# EAGLE design blockybit (EAGLE 9.2.2)

## Sheet 1 of 2
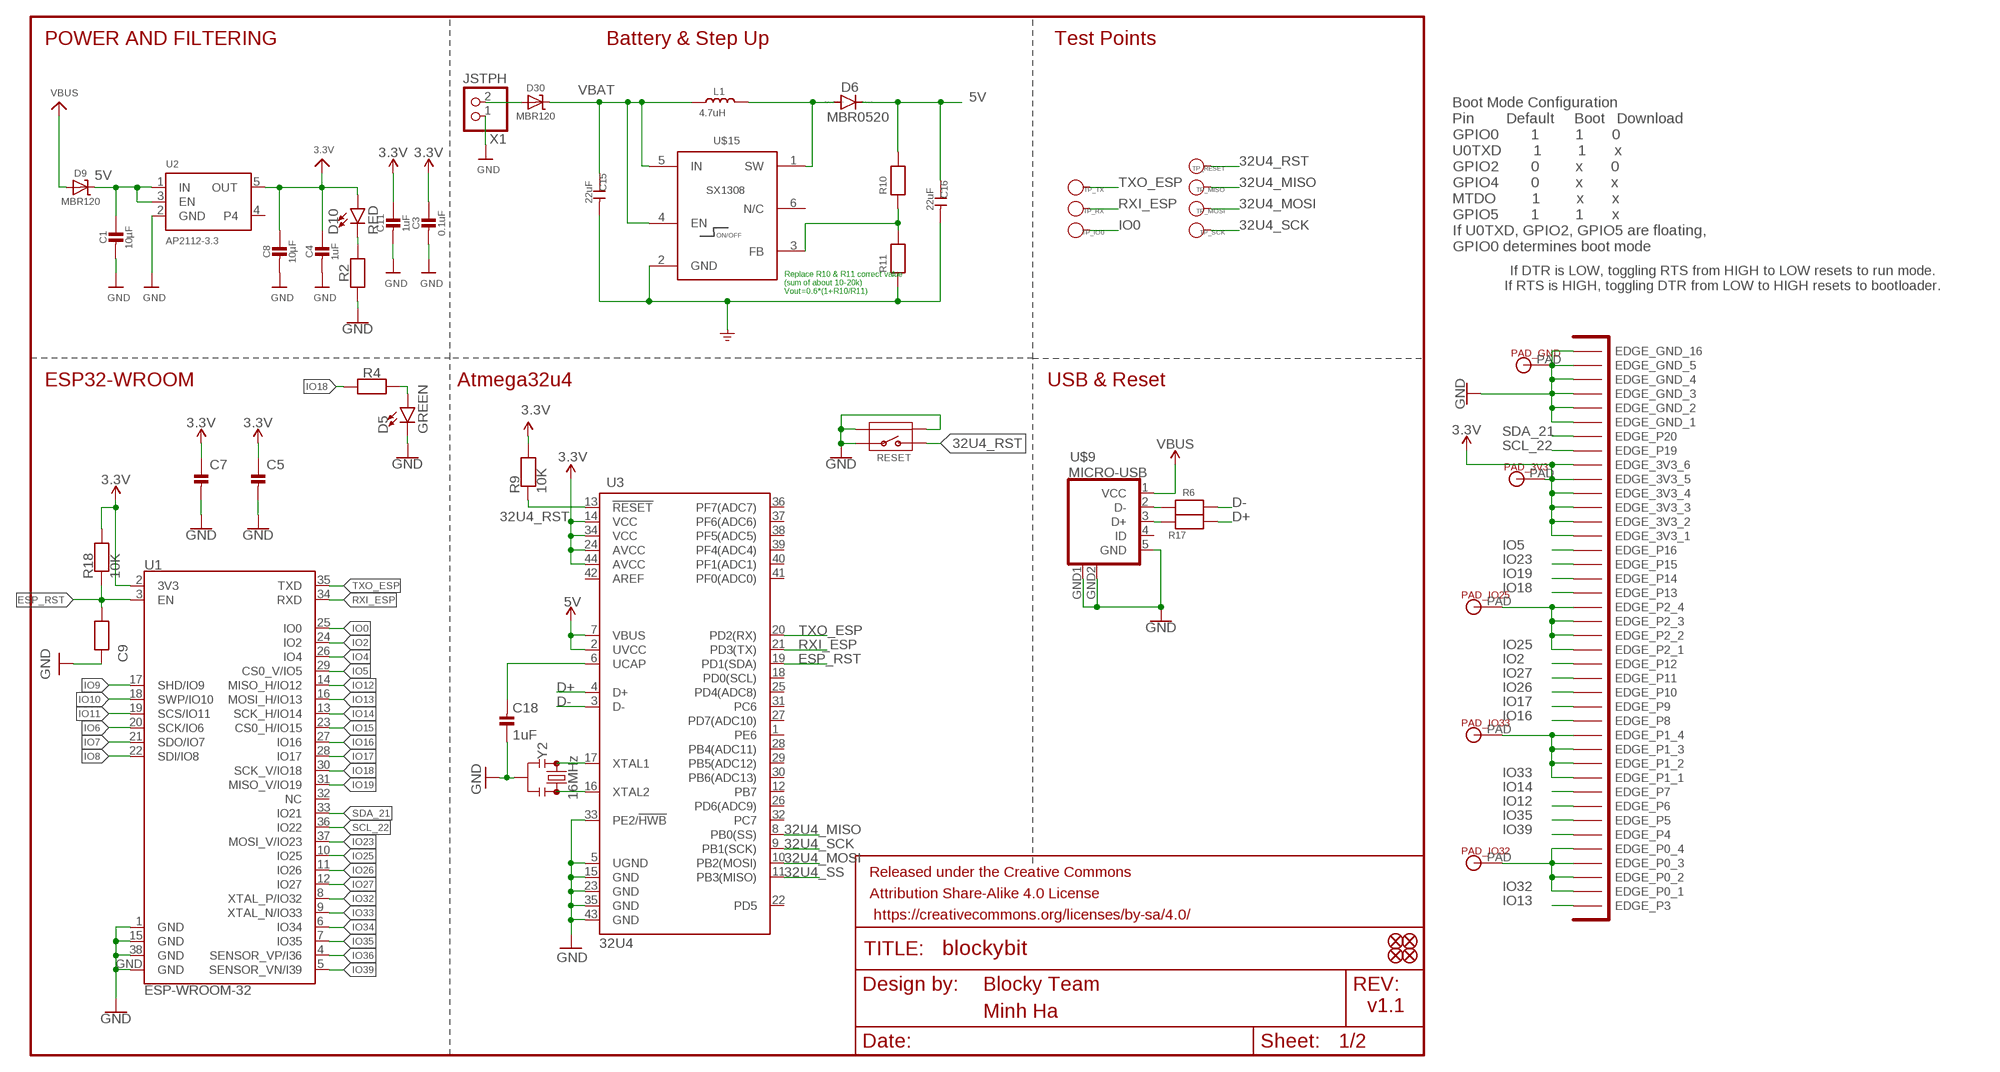
[diagram p0: schematic, sheet 1]

### Parts
C1  10µF  CAP_CERAMIC_0603  [_0603]
C3  0.1uF  CAP_CERAMIC_0603  [_0603]
C4  1uF  CAP_CERAMIC_0603  [_0603]
C5  10uF  CAP_CERAMIC_0603  [_0603]
C7  0.1uF  CAP_CERAMIC_0603  [_0603]
C8  10µF  CAP_CERAMIC_0603  [_0603]
C9  0.1uF  RESISTOR_0603  [_0603]
C11  1uF  CAP_CERAMIC_0603  [_0603]
C15  22uF  C-0805  [C0805]
C16  22uF  C-0805  [C0805]
C18  1uF  CAP_CERAMIC_0603  [_0603]
D5  GREEN  LED-BLUE0603  [LED-0603]
D6  MBR0520  MBR0520LT  [SOD123]
D9  MBR120  DIODE-SCHOTTKYSOD-123  [SOD-123]
D10  RED  LED-RED0603  [LED-0603]
D30  MBR120  DIODE-SCHOTTKYSOD-123  [SOD-123]
FD1  FIDUCIAL1X2  [FIDUCIAL-1X2]
FD2  FIDUCIAL1X2  [FIDUCIAL-1X2]
FD3  FIDUCIAL1X2  [FIDUCIAL-1X2]
FD4  FIDUCIAL1X2  [FIDUCIAL-1X2]
FRAME1  FRAME-LETTERNO_PACKAGE  [DUMMY]
L1  4.7uH  CD32'4R7'  [SD32-4R7MC]
PAD_3V3  MICROBIT_PADMICROBIT_PAD_SMALL  [MICROBIT_PAD_SMALL]
PAD_GND  MICROBIT_PADMICROBIT_PAD_SMALL  [MICROBIT_PAD_SMALL]
PAD_IO25  MICROBIT_PADMICROBIT_PAD_SMALL  [MICROBIT_PAD_SMALL]
PAD_IO32  MICROBIT_PADMICROBIT_PAD_SMALL  [MICROBIT_PAD_SMALL]
PAD_IO33  MICROBIT_PADMICROBIT_PAD_SMALL  [MICROBIT_PAD_SMALL]
R2  1k  RESISTOR_0603  [_0603]
R4  1k  RESISTOR_0603  [_0603]
R6  22R  RESISTOR_0603  [_0603]
R9  10K  RESISTOR_0603  [_0603]
R10  13K  RESISTOR_0603  [_0603]
R11  2K  RESISTOR_0603  [_0603]
R17  22R  RESISTOR_0603  [_0603]
R18  10K  RESISTOR_0603  [_0603]
RESET  BUTTON-4P-REINFORCE'TS-1188E'  [4P-SMD-7X3.5X3.5H]
TP_IO0  PAD-TEST-POINT'3535'  [TP_3535]
TP_MISO  PAD-TEST-POINT'3535'  [TP_3535]
TP_MOSI  PAD-TEST-POINT'3535'  [TP_3535]
TP_RESET  PAD-TEST-POINT'3535'  [TP_3535]
TP_RX  PAD-TEST-POINT'3535'  [TP_3535]
TP_SCK  PAD-TEST-POINT'3535'  [TP_3535]
TP_TX  PAD-TEST-POINT'3535'  [TP_3535]
U1  ESP-WROOM-32  [ESP-WROOM-32]
U2  AP2112-3.3  VREG_SOT23-5  [SOT23-5]
U3  32U4  ATMEGA32U4QFN  [QFN-44]
U$1  BBC_EDGE  [BBC_EDGE]
U$9  MICRO-USB  [MICRO-USB]
U$15  SX1308  [SOT-23-6]
X1  JSTPH  CON_JST_PH_2PIN  [JSTPH2]
Y2  16MHz  RESONATOR-8MHZSMD_3.2X1.3  [RESONATOR-SMD-3.2X1.3]

### Nets
3.3V [usbvcc]: C3.1 C4.1 C5.1 C7.1 C8.1 C11.1 D10.A PAD_3V3.PAD R9.2 R18.2 U1.2(3V3) U2.5(OUT) U3.14(VCC) U3.24(AVCC) U3.34(VCC) U3.44(AVCC) U$1.P$67(EDGE_3V3_1) U$1.P$68(EDGE_3V3_2) U$1.P$69(EDGE_3V3_3) U$1.P$70(EDGE_3V3_4) U$1.P$71(EDGE_3V3_5) U$1.P$72(EDGE_3V3_6) ; supply symbol labelled VCC ; also sheet 2
5V [5v]: C1.1 C16.1 D6.C D9.C R10.2 U2.1(IN) U2.3(EN) U3.2(UVCC) U3.7(VBUS) ; supply symbol labelled VCC ; also sheet 2
32U4_MISO: TP_MISO.T U3.8(PB0(SS))
32U4_MOSI: TP_MOSI.T U3.10(PB2(MOSI))
32U4_RST: R9.1 RESET.2 TP_RESET.T U3.13(!RESET)
32U4_SCK: TP_SCK.T U3.9(PB1(SCK))
32U4_SS: U3.11(PB3(MISO))
D+: R17.1 U3.4(D+)
D-: R6.1 U3.3(D-)
ESP_RST: C9.1 R18.1 U1.3(EN) U3.19(PD1(SDA))
FB1: R10.1 R11.2 U$15.3(FB)
GND [vcc]: C1.2 C3.2 C4.2 C5.2 C7.2 C8.2 C9.2 C11.2 C15.2 C16.2 C18.1 D5.C PAD_GND.PAD R2.1 R11.1 RESET.1 RESET.S1 RESET.S2 U1.1(GND) U1.15(GND) U1.38(GND) U1.GND U2.2(GND) U3.5(UGND) U3.15(GND) U3.23(GND) U3.33(PE2/!HWB) U3.35(GND) U3.43(GND) U$1.P$75(EDGE_GND_1) U$1.P$76(EDGE_GND_2) U$1.P$77(EDGE_GND_3) U$1.P$78(EDGE_GND_4) U$1.P$79(EDGE_GND_5) U$1.P$80(EDGE_GND_16) U$9.5(GND) U$9.GND1(GND) U$9.GND2(GND) U$15.2(GND) X1.1 Y2.2 ; also sheet 2
IO0: TP_IO0.T U1.25(IO0)
IO2: U1.24(IO2) U$1.P$58(EDGE_P12)
IO4: U1.26(IO4) ; also sheet 2
IO5: U1.29(CS0_V/IO5) U$1.P$66(EDGE_P16)
IO6: U1.20(SCK/IO6)
IO7: U1.21(SDO/IO7)
IO8: U1.22(SDI/IO8)
IO9: U1.17(SHD/IO9)
IO10: U1.18(SWP/IO10)
IO11: U1.19(SCS/IO11)
IO12: U1.14(MISO_H/IO12) U$1.P$48(EDGE_P6)
IO13: U1.16(MOSI_H/IO13) U$1.P$41(EDGE_P3)
IO14: U1.13(SCK_H/IO14) U$1.P$49(EDGE_P7)
IO15: U1.23(CS0_H/IO15)
IO16: U1.27(IO16) U$1.P$54(EDGE_P8)
IO17: U1.28(IO17) U$1.P$55(EDGE_P9)
IO18: R4.1 U1.30(SCK_V/IO18) U$1.P$63(EDGE_P13)
IO19: U1.31(MISO_V/IO19) U$1.P$64(EDGE_P14)
IO23: U1.37(MOSI_V/IO23) U$1.P$65(EDGE_P15)
IO25: PAD_IO25.PAD U1.10(IO25) U$1.P$59(EDGE_P2_1) U$1.P$60(EDGE_P2_2) U$1.P$61(EDGE_P2_3) U$1.P$62(EDGE_P2_4) ; also sheet 2
IO26: U1.11(IO26) U$1.P$56(EDGE_P10)
IO27: U1.12(IO27) U$1.P$57(EDGE_P11) ; also sheet 2
IO32: PAD_IO32.PAD U1.8(XTAL_P/IO32) U$1.P$42(EDGE_P0_1) U$1.P$43(EDGE_P0_2) U$1.P$44(EDGE_P0_3) U$1.P$45(EDGE_P0_4)
IO33: PAD_IO33.PAD U1.9(XTAL_N/IO33) U$1.P$50(EDGE_P1_1) U$1.P$51(EDGE_P1_2) U$1.P$52(EDGE_P1_3) U$1.P$53(EDGE_P1_4) ; also sheet 2
IO34: U1.6(IO34) ; also sheet 2
IO35: U1.7(IO35) U$1.P$47(EDGE_P5) ; also sheet 2
IO36: U1.4(SENSOR_VP/I36) ; also sheet 2
IO39: U1.5(SENSOR_VN/I39) U$1.P$46(EDGE_P4)
N$1: D30.A X1.2
N$2: D5.A R4.2
N$4: D10.C R2.2
N$5: U3.16(XTAL2) Y2.3
N$13: R6.2 U$9.2(D-)
N$16: U3.17(XTAL1) Y2.1
N$37: R17.2 U$9.3(D+)
RXI_ESP: TP_RX.T U1.34(RXD) U3.21(PD3(TX))
SCL_22: U1.36(IO22) U$1.P$73(EDGE_P19) ; also sheet 2
SDA_21: U1.33(IO21) U$1.P$74(EDGE_P20) ; also sheet 2
SW1: D6.A L1.2 U$15.1(SW)
TXO_ESP: TP_TX.T U1.35(TXD) U3.20(PD2(RX))
UCAP: C18.2 U3.6(UCAP)
VBAT: C15.1 D30.C L1.1 U$15.4(EN) U$15.5(IN)
VBUS [usbvcc]: D9.A U$9.1(VCC)
Unconnected: U1.32(NC) U2.4 U3.1(PE6) U3.12(PB7) U3.18(PD0(SCL)) U3.22(PD5) U3.25(PD4(ADC8)) U3.26(PD6(ADC9)) U3.27(PD7(ADC10)) U3.28(PB4(ADC11)) U3.29(PB5(ADC12)) U3.30(PB6(ADC13)) U3.31(PC6) U3.32(PC7) U3.36(PF7(ADC7)) U3.37(PF6(ADC6)) U3.38(PF5(ADC5)) U3.39(PF4(ADC4)) U3.40(PF1(ADC1)) U3.41(PF0(ADC0)) U3.42(AREF) U$9.4(ID) U$15.6(N/C)

### Notes on the sheet
- POWER AND FILTERING | Battery & Step Up | Test Points
- Boot Mode Configuration
  Pin        Default     Boot   Download
  GPIO0        1         1       0
  U0TXD        1         1       x
  GPIO2        0         x       0
  GPIO4        0         x       x
  MTDO         1         x       x
  GPIO5        1         1       x
  If U0TXD, GPIO2, GPIO5 are floating, 
  GPIO0 determines boot mode
- If DTR is LOW, toggling RTS from HIGH to LOW resets to run mode.
  If RTS is HIGH, toggling DTR from LOW to HIGH resets to bootloader.
- Replace R10 & R11 correct value 
  (sum of about 10-20k)
  Vout=0.6*(1+R10/R11)
- ESP32-WROOM | Atmega32u4 | USB & Reset
- Blocky Team
- v1.1
- Minh Ha

## Sheet 2 of 2
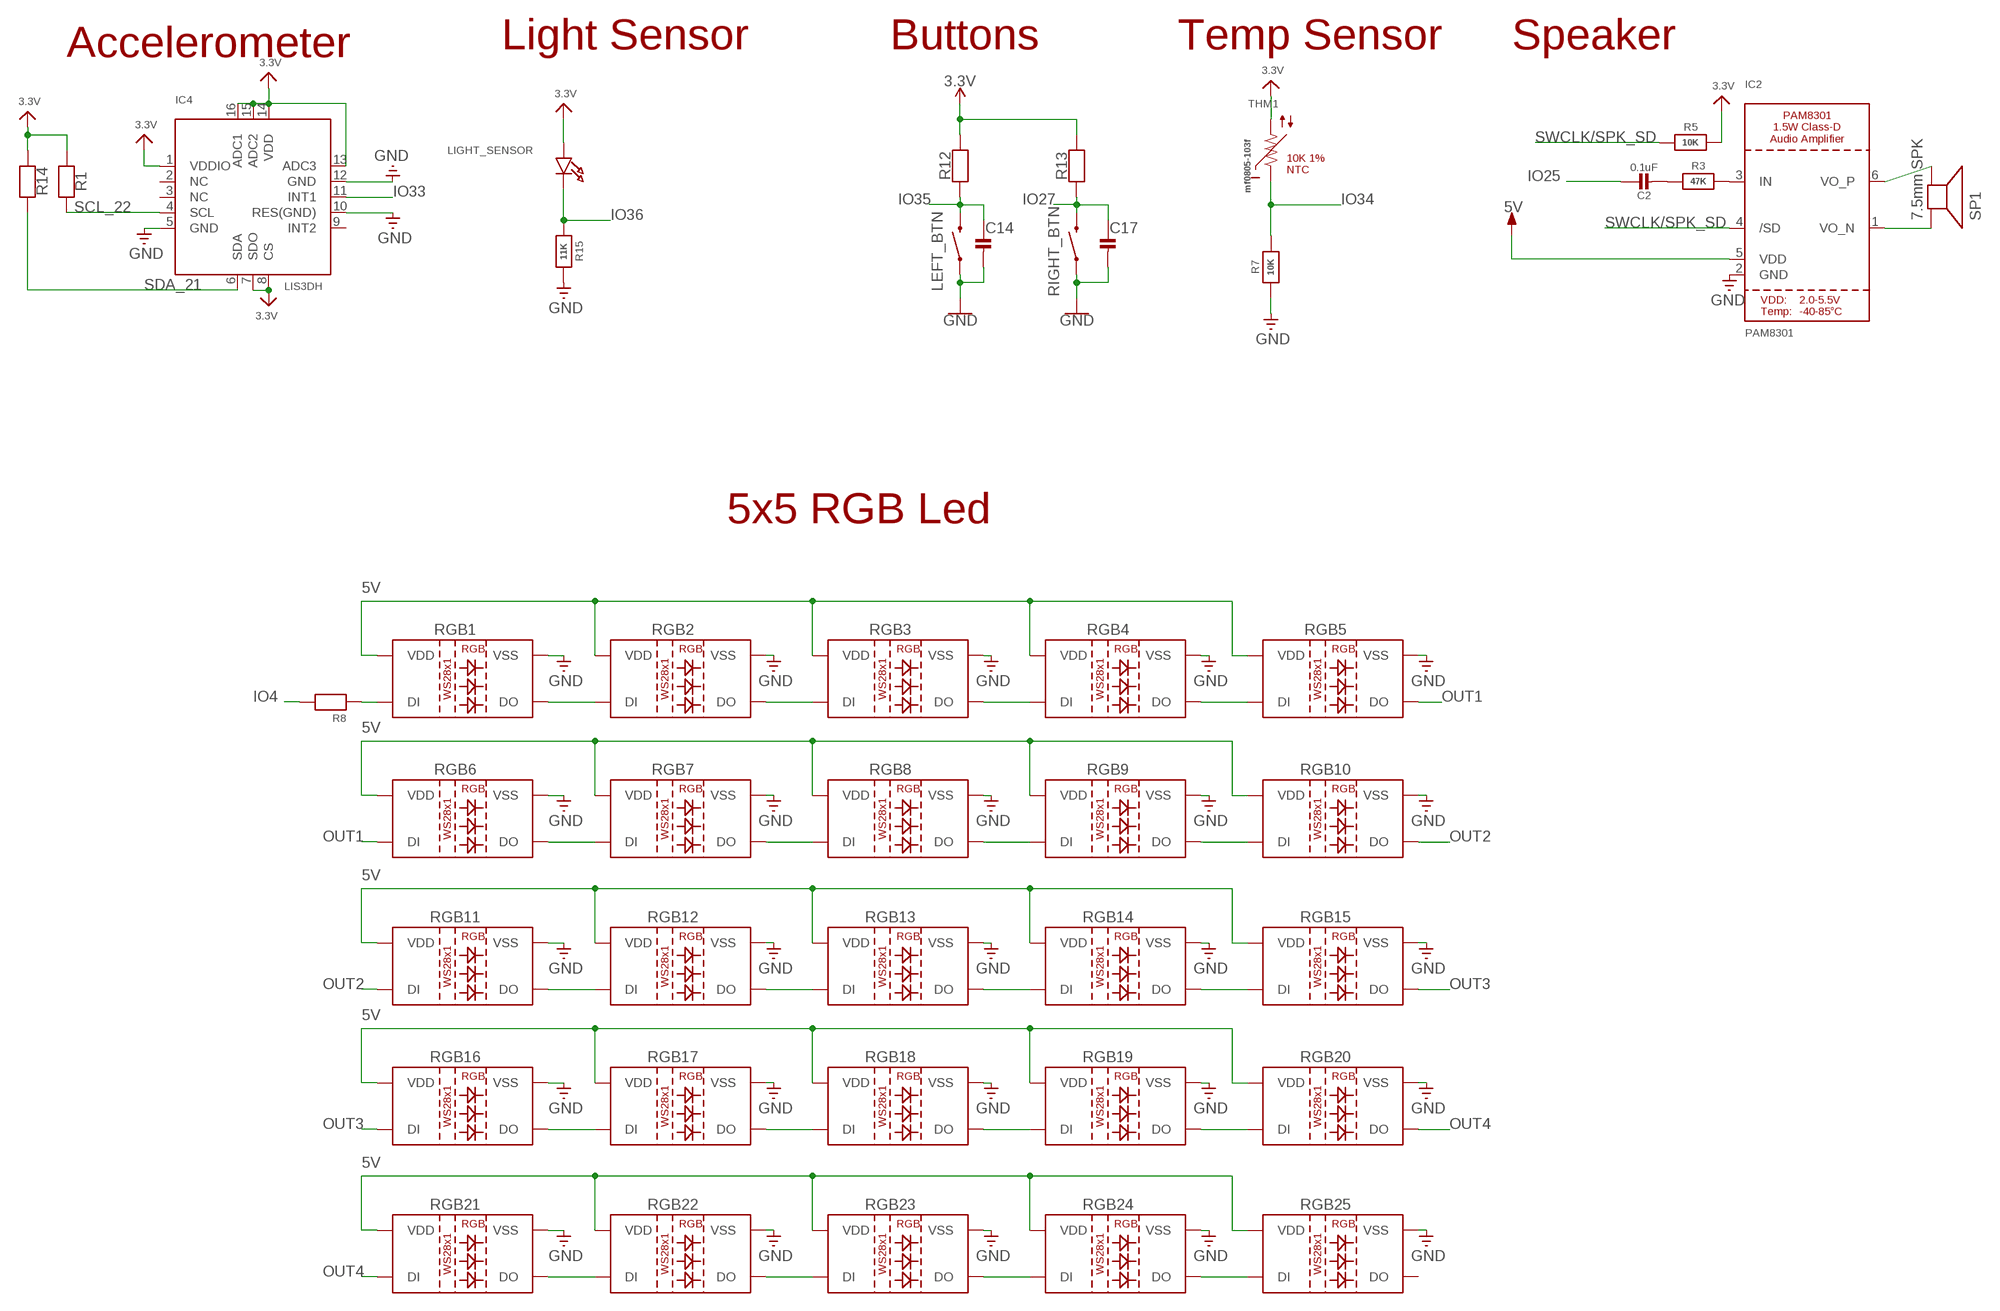
[diagram p1: schematic, sheet 2]

### Parts
C2  0.1uF  CAP_CERAMIC_0603  [_0603]
C14  10pF  CAP_CERAMIC_0603  [_0603]
C17  10pF  CAP_CERAMIC_0603  [_0603]
IC2  PAM8301  [SOT23-6]
IC4  LIS3DH  ACCEL_LIS3DHTR  [LGA16_3X3MM]
LEFT_BTN  MOMENTARY-SWITCH-SPST-SMD-6.2MM-TALL  [TACTILE_SWITCH_SMD_6.2MM_TALL]
LIGHT_SENSOR  LED0805  [CHIPLED_0805]
R1  10K  RESISTOR_0603  [_0603]
R3  47K  RESISTOR_0603  [_0603]
R5  10K  RESISTOR_0603  [_0603]
R7  10K  RESISTOR_0603  [_0603]
R8  470  RESISTOR_0603  [_0603]
R12  10K  RESISTOR_0603  [_0603]
R13  10K  RESISTOR_0603  [_0603]
R14  10K  RESISTOR_0603  [_0603]
R15  11K  RESISTOR_0603  [_0603]
RGB1  WS2812B  WS2812BWS2812B-3535  [WS2812B-3535]
RGB2  WS2812B  WS2812BWS2812B-3535  [WS2812B-3535]
RGB3  WS2812B  WS2812BWS2812B-3535  [WS2812B-3535]
RGB4  WS2812B  WS2812BWS2812B-3535  [WS2812B-3535]
RGB5  WS2812B  WS2812BWS2812B-3535  [WS2812B-3535]
RGB6  WS2812B  WS2812BWS2812B-3535  [WS2812B-3535]
RGB7  WS2812B  WS2812BWS2812B-3535  [WS2812B-3535]
RGB8  WS2812B  WS2812BWS2812B-3535  [WS2812B-3535]
RGB9  WS2812B  WS2812BWS2812B-3535  [WS2812B-3535]
RGB10  WS2812B  WS2812BWS2812B-3535  [WS2812B-3535]
RGB11  WS2812B  WS2812BWS2812B-3535  [WS2812B-3535]
RGB12  WS2812B  WS2812BWS2812B-3535  [WS2812B-3535]
RGB13  WS2812B  WS2812BWS2812B-3535  [WS2812B-3535]
RGB14  WS2812B  WS2812BWS2812B-3535  [WS2812B-3535]
RGB15  WS2812B  WS2812BWS2812B-3535  [WS2812B-3535]
RGB16  WS2812B  WS2812BWS2812B-3535  [WS2812B-3535]
RGB17  WS2812B  WS2812BWS2812B-3535  [WS2812B-3535]
RGB18  WS2812B  WS2812BWS2812B-3535  [WS2812B-3535]
RGB19  WS2812B  WS2812BWS2812B-3535  [WS2812B-3535]
RGB20  WS2812B  WS2812BWS2812B-3535  [WS2812B-3535]
RGB21  WS2812B  WS2812BWS2812B-3535  [WS2812B-3535]
RGB22  WS2812B  WS2812BWS2812B-3535  [WS2812B-3535]
RGB23  WS2812B  WS2812BWS2812B-3535  [WS2812B-3535]
RGB24  WS2812B  WS2812BWS2812B-3535  [WS2812B-3535]
RGB25  WS2812B  WS2812BWS2812B-3535  [WS2812B-3535]
RIGHT_BTN  MOMENTARY-SWITCH-SPST-SMD-6.2MM-TALL  [TACTILE_SWITCH_SMD_6.2MM_TALL]
SP1  7.5mm SPK  SPEAKER_7.5MM  [BUZZER_SMT_7.5MM]
THM1  mf0805-103f  NCP-0805  [R0805]

### Nets
3.3V [usbvcc]: IC4.1(VDDIO) IC4.7(SDO) IC4.8(CS) IC4.13(ADC3) IC4.14(VDD) IC4.15(ADC2) IC4.16(ADC1) LIGHT_SENSOR.A R1.1 R5.2 R12.2 R13.2 R14.1 THM1.2 ; also sheet 1
5V [5v]: IC2.5(VDD) RGB1.1(VDD) RGB2.1(VDD) RGB3.1(VDD) RGB4.1(VDD) RGB5.1(VDD) RGB6.1(VDD) RGB7.1(VDD) RGB8.1(VDD) RGB9.1(VDD) RGB10.1(VDD) RGB11.1(VDD) RGB12.1(VDD) RGB13.1(VDD) RGB14.1(VDD) RGB15.1(VDD) RGB16.1(VDD) RGB17.1(VDD) RGB18.1(VDD) RGB19.1(VDD) RGB20.1(VDD) RGB21.1(VDD) RGB22.1(VDD) RGB23.1(VDD) RGB24.1(VDD) RGB25.1(VDD) ; supply symbol labelled VCC ; also sheet 1
GND [vcc]: C14.2 C17.2 IC2.2(GND) IC4.5(GND) IC4.10(RES(GND)) IC4.12(GND) LEFT_BTN.A2 R7.1 R15.1 RGB1.3(VSS) RGB2.3(VSS) RGB3.3(VSS) RGB4.3(VSS) RGB5.3(VSS) RGB6.3(VSS) RGB7.3(VSS) RGB8.3(VSS) RGB9.3(VSS) RGB10.3(VSS) RGB11.3(VSS) RGB12.3(VSS) RGB13.3(VSS) RGB14.3(VSS) RGB15.3(VSS) RGB16.3(VSS) RGB17.3(VSS) RGB18.3(VSS) RGB19.3(VSS) RGB20.3(VSS) RGB21.3(VSS) RGB22.3(VSS) RGB23.3(VSS) RGB24.3(VSS) RGB25.3(VSS) RIGHT_BTN.A2 ; also sheet 1
IO4: R8.2 ; also sheet 1
IO25: C2.1 ; also sheet 1
IO27: C17.1 R13.1 RIGHT_BTN.B2 ; also sheet 1
IO33: IC4.11(INT1) ; also sheet 1
IO34: R7.2 THM1.1 ; also sheet 1
IO35: C14.1 LEFT_BTN.B2 R12.1 ; also sheet 1
IO36: LIGHT_SENSOR.C R15.2 ; also sheet 1
N$6: C2.2 R3.1
N$9: IC2.3(IN) R3.2
N$10: IC2.6(VO_P) SP1.-
N$11: IC2.1(VO_N) SP1.+
N$14: RGB1.2(DO) RGB2.4(DI)
N$15: RGB2.2(DO) RGB3.4(DI)
N$17: RGB3.2(DO) RGB4.4(DI)
N$18: RGB4.2(DO) RGB5.4(DI)
N$21: RGB6.2(DO) RGB7.4(DI)
N$22: RGB7.2(DO) RGB8.4(DI)
N$23: R8.1 RGB1.4(DI)
N$24: RGB8.2(DO) RGB9.4(DI)
N$25: RGB9.2(DO) RGB10.4(DI)
N$28: RGB11.2(DO) RGB12.4(DI)
N$29: RGB12.2(DO) RGB13.4(DI)
N$31: RGB13.2(DO) RGB14.4(DI)
N$32: RGB14.2(DO) RGB15.4(DI)
N$35: RGB16.2(DO) RGB17.4(DI)
N$36: RGB17.2(DO) RGB18.4(DI)
N$38: RGB18.2(DO) RGB19.4(DI)
N$39: RGB19.2(DO) RGB20.4(DI)
N$42: RGB21.2(DO) RGB22.4(DI)
N$43: RGB22.2(DO) RGB23.4(DI)
N$45: RGB23.2(DO) RGB24.4(DI)
N$46: RGB24.2(DO) RGB25.4(DI)
OUT1: RGB5.2(DO) RGB6.4(DI)
OUT2: RGB10.2(DO) RGB11.4(DI)
OUT3: RGB15.2(DO) RGB16.4(DI)
OUT4: RGB20.2(DO) RGB21.4(DI)
SCL_22: IC4.4(SCL) R1.2 ; also sheet 1
SDA_21: IC4.6(SDA) R14.2 ; also sheet 1
SWCLK/SPK_SD: IC2.4(/SD) R5.1
Unconnected: IC4.2(NC) IC4.3(NC) IC4.9(INT2) RGB25.2(DO)

### Notes on the sheet
- Accelerometer | Light Sensor | Buttons | Temp Sensor | Speaker
- 10K 1%
  NTC
- 5x5 RGB Led

## Library data of the parts
C1-C5 C7 C8 C11 C14 C17 C18 = microbuilder:CAP_CERAMIC: Ceramic Capacitors 0402 - 0402 Surface Mount Capacitors 16pF 50V 5% [Digikey: 445-4899-2-ND] 18pF 50V 5% [Digikey: 490-1281-2-ND] 22pF 50V 5% [Digikey: 490-1283-2-ND] 68pF 50V 5% [Digikey: 490-1289-2-ND] 0.1uF 10V 10% [Digikey: 490-1318-2-ND] 1.0uF 6.3V 10% [Digikey: 490-1320-2-ND] 0603 - 0603 Surface Mount Capacitors 16 pF 50V 5% [Digikey: 445-5051-2-ND] 22 pF 50V [Digikey: PCC220ACVTR-ND] 33 pF 50V 5% [Digikey: 490-1415-1-ND] 56pF 50V 5% [Digikey: 490-1421-1-ND] 220pF 50V 5% [Digikey: 445-1285-1-ND] 680 pF 50V 2200 pF 50V 5% C0G [Digikey: 445-1297-1-ND] 5600 pF 100V 5% X7R [Digikey: 478-3711-1-ND] 0.1 µF 25V 10% [Digikey: PCC2277TR-ND] 0.22 µF 16V 10% X7R [Digikey: 445-1318-1-ND] 1.0 µF 25V 10% [Digikey: 445-5146-2-ND] 0603 - RF Specific 3pF 250V +/-0.1pF RF [Digikey: 712-1347-1-ND] 18 pF 250V 5% [Digikey: 478-3505-1-ND or 712-1322-1-ND] 56 pF 250V 5% C0G RF [Digikey: 490-4867-1-ND] 68 pF 250V RF [Digikey: 490-4868-1-ND] 0805 - 0805 Surface Mount Capacitors 220 pF 250V 2% RF Ceramic Capacitor [Digikey: 712-1398-1-ND] 1000 pF 50V 2% NP0 Ceramic Capacitor [Digikey: 478-3760-1-ND] 0.1 µF 25V 10% Ceramic Capacitor [Digikey: PCC1828TR-ND] 1.0 µF 16V 10% Ceramic Capacitor[Digikey: 490-1691-2-ND] 10.0 µF 10V 10% Ceramic Capacitor[Digikey: 709-1228-1-ND] 10.0 uF 16V 10% Ceramic Capacitor [Digikey: 478-5165-2-ND] 47 uF 6.3V 20% Ceramic Capacitor [Digikey: 587-1779-1-ND or 399-5506-1-ND] 1206 - 1206 Surface Mount Capacitors 47uF 10V 20% Ceramic Capacitor [Digikey: 490-5528-1-ND or 399-5508-1-ND or 445-6010-1-ND] 100uF 6.3V -20%, +80% Y5V Ceramic Capacitor (Digikey: 490-4512-1-ND, Mouser: 81-GRM31CF50J107ZE1L)
C9 R1-R15 R17 R18 = microbuilder:RESISTOR: Resistors 0402 - 0402 Surface Mount Package 22 Ohm 1% 1/16W [Digikey: 311-22.0LRTR-ND] 33 Ohm 5% 1/16W 1.0K 5% 1/16W 1.5K 5% 1/16W 2.0K 1% 1/16W 10.0K 1% 1/16W [Digikey: 311-10.0KLRTR-ND] 10.0K 5% 1/16W [Digikey: RMCF0402JT10K0TR-ND] 12.1K 1% 1/16W [Digikey: 311-22.0LRTR-ND] 100.0K 5% 1/16W 0603 - 0603 Surface Mount Package 0 Ohm 1/10 Watt 1% Resistor 15 Ohm 1/10 Watt 1% Resistor 33 Ohm 1/10 Watt 1% Resistor 49.9 Ohm 1/10 Watt 1% Resistor 100 Ohm 1/10 Watt 1% Resistor 150 Ohm 1/10 Watt 1% Resistor 240 Ohm 1/10 Watt 1% Resistor 390 Ohm 1/10 Watt 1% Resistor 560 Ohm 1/10 Watt 1% Resistor 680 Ohm 1/10 Watt 1% Resistor 750 Ohm 1/10 Watt 1% Resistor 1.0K Ohm 1/10 Watt 1% Resistor 1.5K Ohm 1/10 Watt 1% Resistor 2.0K Ohm 1/10 Watt 1% Resistor 2.2K Ohm 1/10 Watt 1% Resistor 3.3K Ohm 1/10 Watt 1% Resistor 4.7K Ohm 1/10 Watt 1% Resistor 10.0K Ohm 1/10 Watt 1% Resistor 12.0K Ohm 1/10 Watt 1% Resistor 12.1K Ohm 1/10 Watt 1% Resistor 20.0K Ohm 1/10 Watt 1% Resistor 33.0K Ohm 1/10 Watt 1% Resistor 100.0K Ohm 1/10 Watt 1% Resistor 0805 - 0805 Surface Mount Package 0 Ohm 1/8 Watt 1% Resistor 33 Ohm 1/8 Watt 1% Resistor 100 Ohm 1/8 Watt 1% Resistor 150 Ohm 1/8 Watt 1% Resistor 200 Ohm 1/8 Watt 1% Resistor 240 Ohm 1/8 Watt 1% Resistor 330 Ohm 1/8 Watt 1% Resistor 390 Ohm 1/8 Watt 1% Resistor 470 Ohm 1/8 Watt 1% Resistor 1.0K Ohm 1/8 Watt 1% Resistor 1.5K Ohm 1/8 Watt 1% Resistor 2.0K Ohm 1/8 Watt 1% Resistor 4.7K Ohm 1/8 Watt 1% Resistor 5.1K Ohm 1/8 Watt 1% Resistor 5.6K Ohm 1/8 Watt 1% Resistor 10.0K Ohm 1/8 Watt 1% Resistor 22.0K Ohm 1/8 Watt 1% Resistor 33.0K Ohm 1/8 Watt 1% Resistor 100K Ohm 1/8 Watt 1% Resistor 1206 - 1206 Surface Mount Package 2012 - 2010 Surface Mount Package 0.11 Ohm 1/2 Watt 1% Resistor - Digikey: RHM.11UCT-ND
C15 C16 = Discrete:C*: Ceramic Capacitors
D5 = SparkFun-LED:LED-BLUE: Blue SMD LED Used in manufacturing of various products at SparkFun Packages: 0603 - SMD 0603 package [Product Link] <http://www.digikey.com/product-detail/en/SMLE12BC7TT86/511-1589-2-ND/1641808> 1206 - SMD1206 package [Product Link] <http://www.digikey.com/product-detail/en/lite-on-inc/LTST-C150TBKT/160-1643-1-ND/573584> SparkFun Products: ESP8266 Thing-Dev Board <https://www.sparkfun.com/products/13711> RedBoard <https://www.sparkfun.com/products/12757>; PROD_ID: DIO-08575; VALUE: BLUE
D6 = diode:MBR0520LT: SCHOTTKY BARRIER RECTIFIER Source: http://onsemi.com .. MBR0520LT1-D.pdf
D9 D30 = microbuilder:DIODE-SCHOTTKY
D10 = SparkFun-LED:LED-RED: Red SMD LED Used in manufacturing of most products at SparkFun Packages: 0603 - SMD 0603 package [Product Link] <http://docs.avagotech.com/docs/AV02-0551EN> 0603 SMART - SMD 0603 SMART package ( more efficient and expensive)[Product Link] <http://www.osram-os.com/Graphics/XPic2/00077099_0.pdf> 1206 - SMD1206 package [Product Link] <https://www.sparkfun.com/datasheets/DevTools/LilyPad/Q150OVS4.pdff> SparkFun Products: Pro Mini 328 -5V <https://www.sparkfun.com/products/821> RedBoard <https://www.sparkfun.com/products/12757> IOIO-OTG <https://www.sparkfun.com/products/13613>; PROD_ID: DIO-00819
FD1-FD4 = SparkFun-Aesthetics:FIDUCIAL: Fiducial Alignment Points Point-of-reference for pick-and-place machines and other optical instruments.
FRAME1 = SparkFun-Aesthetics:FRAME-LETTER: Schematic Frame - Letter Standard 8.5x11 US Letter frame; DESIGNER: Nobody; VERSION: v01
IC2 = microbuilder:PAM8301
IC4 = microbuilder:ACCEL_LIS3DHTR: LIS3DHTR 3-Axis Accelerometer with I2C/SPI Interface VDD: 1.71-3.6V VDDIO: 1.71-VDD+0.1V Scale: +/-2g, 4g, 8g, 16g with 16--bit data output Temp:: -40°C - 85°C Mouser: 511-LIS3DHTR Digikey: 497-10613-1-ND
L1 = template:CD32: ferrite cored coil
LEFT_BTN RIGHT_BTN = SparkFun-Switches:MOMENTARY-SWITCH-SPST: Momentary Switch (Pushbutton) - SPST Normally-open (NO) SPST momentary switches (buttons, pushbuttons). Variants PTH-12MM - 12mm square, through-hole Momentary Pushbutton Switch - 12mm Square <https://www.sparkfun.com/products/9190> (COM-09190) PTH-6.0MM, PTH-6.0MM-KIT - 6.0mm square, through-hole Mini Pushbutton Switch <https://www.sparkfun.com/products/97> (COM-00097) KIT package intended for soldering kit's - only one side of pads' copper is exposed. PTH-RIGHT-ANGLE-KIT - Right-angle, through-hole Right Angle Tactile Button <https://www.sparkfun.com/products/10791> - Used on SparkFun BigTime Watch Kit <https://www.sparkfun.com/products/11734> SMD-12MM - 12mm square, surface-mount Tactile Button - SMD (12mm) <https://www.sparkfun.com/products/12993> (COM-12993) Used on SparkFun PicoBoard <https://www.sparkfun.com/products/11888> SMD-4.5MM - 4.5mm Square Trackball Switch Used on SparkFun Blackberry Trackballer Breakout <https://www.sparkfun.com/products/13169> SMD-4.6MMX2.8MM - 4.60mm x 2.80mm, surface mount Used on SparkFun SAMD21 Mini Breakout <https://www.sparkfun.com/products/13664> SMD-5.2MM, SMD-5.2-REDUNDANT - 5.2mm square, surface-mount Mini Pushbutton Switch - SMD <https://www.sparkfun.com/products/8720> (COM-08720) Used on Arduino Pro Mini <https://www.sparkfun.com/products/11114> REDUNDANT package connects both switch circuits together SMD-6.0X3.5MM - 6.0 x 3.5mm, surface mount Momentary Reset Switch SMD <https://www.sparkfun.com/products/8229> (COM-08229) SMD-6.2MM-TALL - 6.2mm square, surface mount Tactile Button - SMD (6mm) <https://www.sparkfun.com/products/12992> Used on SparkFun Digital Sandbox <https://www.sparkfun.com/products/12651> SMD-RIGHT-ANGLE - Right-angle, surface mount Used on SparkFun Block for Intel® Edison - Arduino <https://www.sparkfun.com/products/13036>; PROD_ID: SWCH-11966; SF_SKU: COM-12992
LIGHT_SENSOR = microbuilder:LED: LED 0603 - 0603 Surface Mount Package 2mA: Green LED - Low Power (3.9mcd, 2ma, 1.7Vf) - Digikey: 475-2709-2-ND Orange LED - Low Power (9.8mcd, 2ma, 1.8Vf) - Digikey: 475-1194-2-ND Red LED - Low Power (5mcd, 2ma, 1.8Vf) - Digikey: 475-1195-2-ND Yellow LED - Low Power (7mcd, 2ma, 1.8Vf) - Digikey: 475-1196-2-ND 5mA: Blue LED - Low Power (17mcd, 5ma, 2.9Vf) - Digikey: LNJ937W8CRACT-ND 0805 - 0805 Surface Mount Package 2mA: Red LED (8.8mcd, 2mA, 1.8Vf, Clear) - Low Power [Digikey: 475-2510-1-ND] Green LED (5mcd, 2mA, 1.8Vf, Clear) - Low Power [Digikey: 475-2730-1-ND] Yellow LED (11.3mcd, 2mA, 1.8Vf, Clear) - Low Power [Digikey: 475-2555-1-ND] 20mA: Red LED (104mcd, 20mA, Diffused) - LS R976 [Digikey: 475-1278-6-ND] Red LED (12mcd, 20mA, 2.0Vf, Clear) - APT2012EC [Digikey: 754-1128-1-ND] Green LED (15mcd, 20mA, 2.2Vf, Clear) - APT2012GC [Digikey: 754-1131-1-ND] Orange LED (160mcd, 20mA, 2.1Vf, Clear) - APT2012SECK [Digikey: 754-1130-1-ND] 1206 - 1206 Surface Mount Package Green LED (26mcd, 20mA, Diffused) - LG N971 [Digikey: 475-1407-6-ND] Red LED (15mcd, 20mA, Diffused) - LH N974 [Digikey: 475-1416-6-ND]
PAD_3V3 PAD_GND PAD_IO25 PAD_IO32 PAD_IO33 = microbit:MICROBIT_PAD
RESET = Discrete:BUTTON-4P-REINFORCE: TS-1188E http://www.best-dz.com/?thread-374-2.html
RGB1-RGB25 = Blocky:WS2812B: WS2812B SMD addressable RGB LED 5x5mm SMD LED with built-in controller IC. Color: Red/Green/Blue mC Rating: RGB: 390, 660, 180 mcd Forward Voltage: RGB: 2.0, 3.0, 3.0 V Packages:WS2812B SparkFun Products: Blynk Board - ESP8266 <https://www.sparkfun.com/products/13794>
SP1 = microbuilder:SPEAKER: SPEAKER Source: Buerklin Added PS12 (for part # PS1240 piezo) http://www.ladyada.net/library/pcb/eaglelibrary.html
THM1 = ptc-ntc:NCP: NTC THERMISTOR
TP_IO0 TP_MISO TP_MOSI TP_RESET TP_RX TP_SCK TP_TX = Discrete:PAD-TEST-POINT; PARTNO: DNP
U1 = SparkFun-RF:ESP-WROOM-32; PROD_ID: IC-13849
U2 = microbuilder:VREG_SOT23-5: SOT23-5 Fixed Voltage Regulators To better organise some of the SOT23-5 fixed voltage regulators in this library, this new part was created. Part Current Out V Out V In V Dropout Digikey Part No. ADP121 150mA 3.3V 3.4-5.5V 0.09V @ 150mA ADP121-AUJZ33R7CT-ND ADP121 150mA 3.0V 3.1-5.5V 0.09V @ 150mA ADP121-AUJZ30R7CT-ND ADP122 300mA 3.3V 3.4-5.5V 0.085V @ 300mA ADP122AUJZ-3.3-R7CT-ND ADP1712 300mA 3.3V 3.5-5.5V 0.17V @ 300mA ADP1712AUJZ-3.3-R7TR-ND AP7311 (Low Cost) 150mA 3.3V 3.5-6V 0.15V @ 150mA AP7311-33WG-7DICT-ND LD39015M18R 150mA 1.8V 1.9V-5.5V 0.08V @ 100mA 497-6977-1-ND MCP1824T-3302E/OT 300mA 3.3V 3.5V-6V 0.2V @ 300mA MCP1824T-3302E/OTCT-ND MIC5205-2.5YM5 TR 150mA 2.5V 2.7-16V 0.165V @ 150mA 576-1257-2-ND MIC5205-3.0YM5 TR 150mA 3.0V 3.2V-16V 0.165V @ 150mA 576-1258-2-ND MIC5205-3.3YM5 TR 150mA 3.3V 3.5V-16V 0.165V @ 150mA 576-1259-2-ND TPS780330220 150mA 3.3V+2.2V 3.6-5.5V 250mV Max 296-23332-1-ND TDA3663/N1,135 100mA 3.3V 3.5-45V 0.18V @ 50mA 568-5343-1-ND
U3 = SparkFun-IC-Microcontroller:ATMEGA32U4: Atmel MCU, 32KByte Atmel 44-pin 8-bit Microcontroller with 32KBytes of ISP Flash and USB Controller Datasheet <http://cdn.sparkfun.com/datasheets/Dev/Arduino/Boards/ATMega32U4.pdf> SparkFun Products LilyPad Arduino USB - ATmega32U4 Board <https://www.sparkfun.com/products/12049> (DEV-12049) Pro Micro - 5V/16MHz <https://www.sparkfun.com/products/12640> (DEV-12640) Pro Micro - 3.3V/8MHz <https://www.sparkfun.com/products/12587> (DEV-12587) Fio v3 - ATmega32U4 <https://www.sparkfun.com/products/11520> (DEV-11520) Qduino Mini <https://www.sparkfun.com/products/13614> (DEV-13614) Makey Makey - Standard Kit <https://www.sparkfun.com/products/11511> (WIG-11511) Makey Makey Deluxe Kit <https://www.sparkfun.com/products/11519> (WIG-11519); PROD_ID: IC-10828
U$1 = microbit:BBC_EDGE
U$9 = My-Eagle-Lib:MICRO-USB: Micro USB B connector
U$15 = SX1308:SX1308: SX1308 – 1.2MHz, 2A Step Up Converter – Suosemi; AVAILABILITY: Unavailable; DESCRIPTION: Digital Baseband Chip For Indoor Lorawan Pico Gateways; MF: Semtech; MP: SX1308; PACKAGE: None; PRICE: None
X1 = microbuilder:CON_JST_PH_2PIN: JST 2-Pin Right-Angle Connector PH-Series - 4UConnector: 17311 SH-Series - 4UConnector: 07278
Y2 = SparkFun-Clocks:RESONATOR-8MHZ: 8MHz Resonator Digikey Example <http://www.digikey.com/product-detail/en/murata-electronics-north-america/CSTCE10M0G55-R0/490-1196-1-ND/584633> Frequency: 8MHz Frequency Stability: ±0.2% Frequency Tolerance: ±0.5% Capacitance: 33pF SparkFun Products Arduino Pro Mini 328- 3.3V/8MHz <https://www.sparkfun.com/products/11114> SparkFun Digital Sandbox <https://www.sparkfun.com/products/12651>; PROD_ID: XTAL-08895; VALUE: 8MHz

## Net classes
1 vcc: width 0.254 mm
2 5v: width 0.254 mm
3 usbvcc: width 0.254 mm, drill 0.356 mm, clearance 0.203 mm

## Board
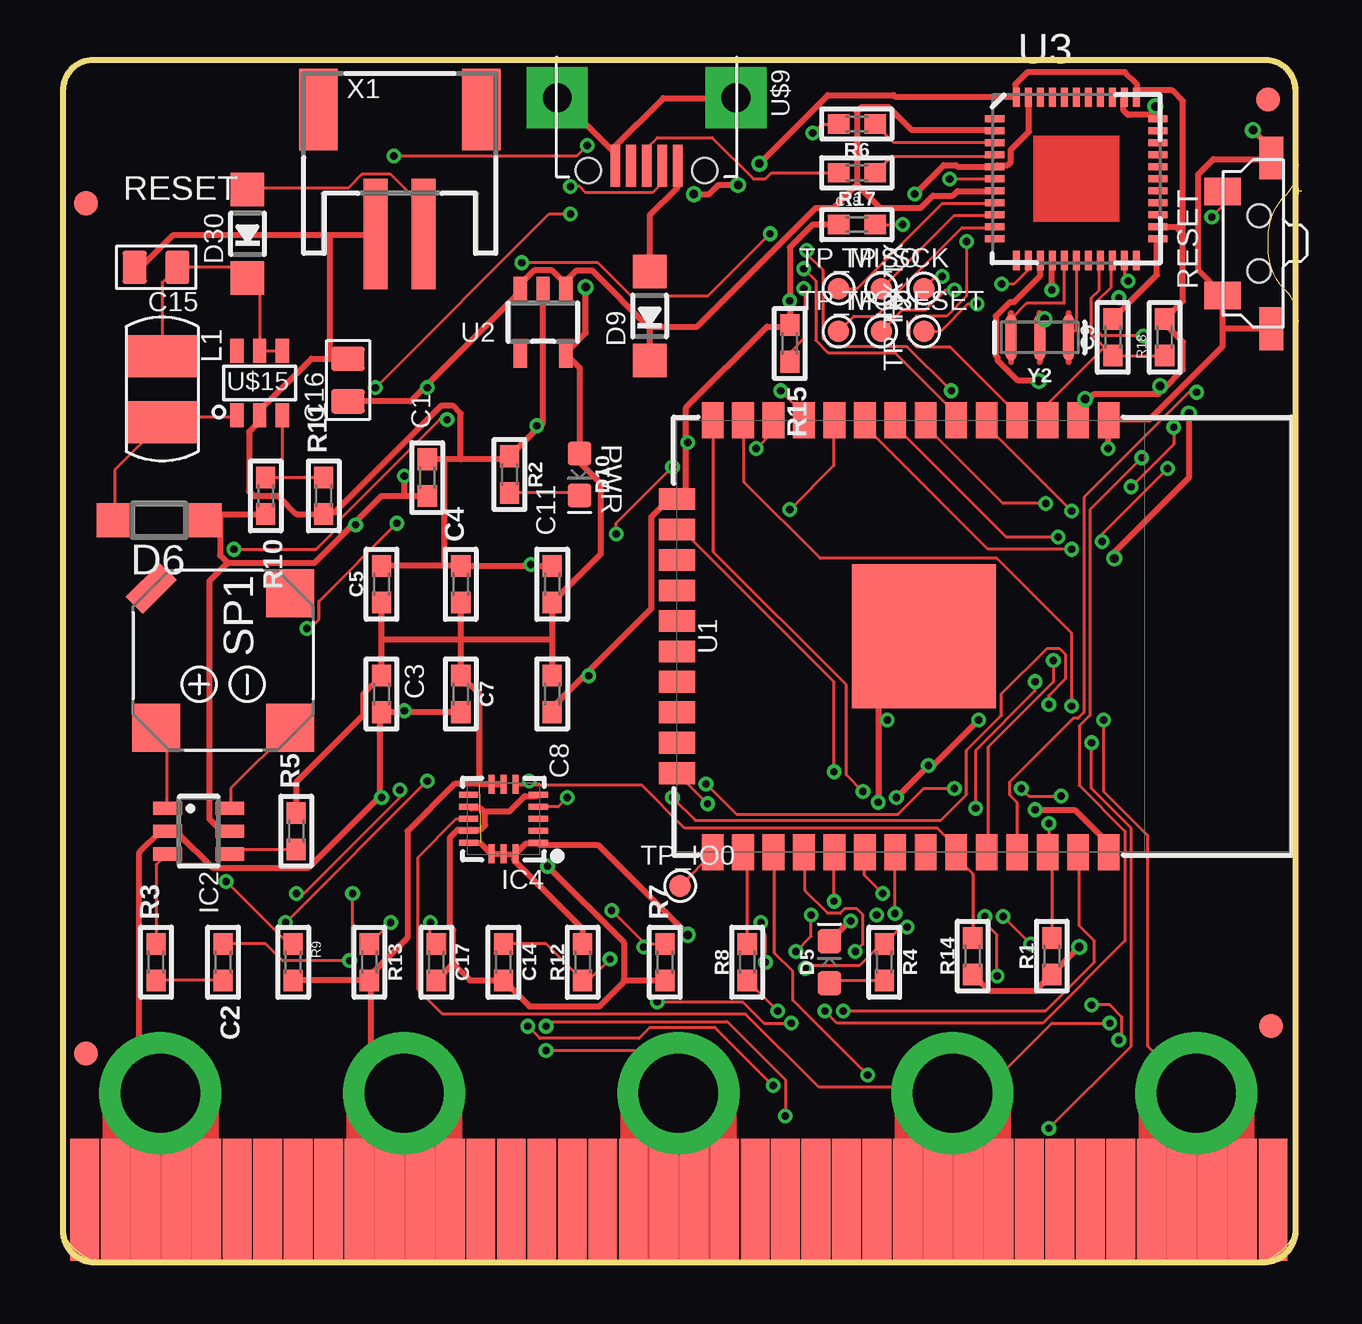
[diagram p2: board, top side]
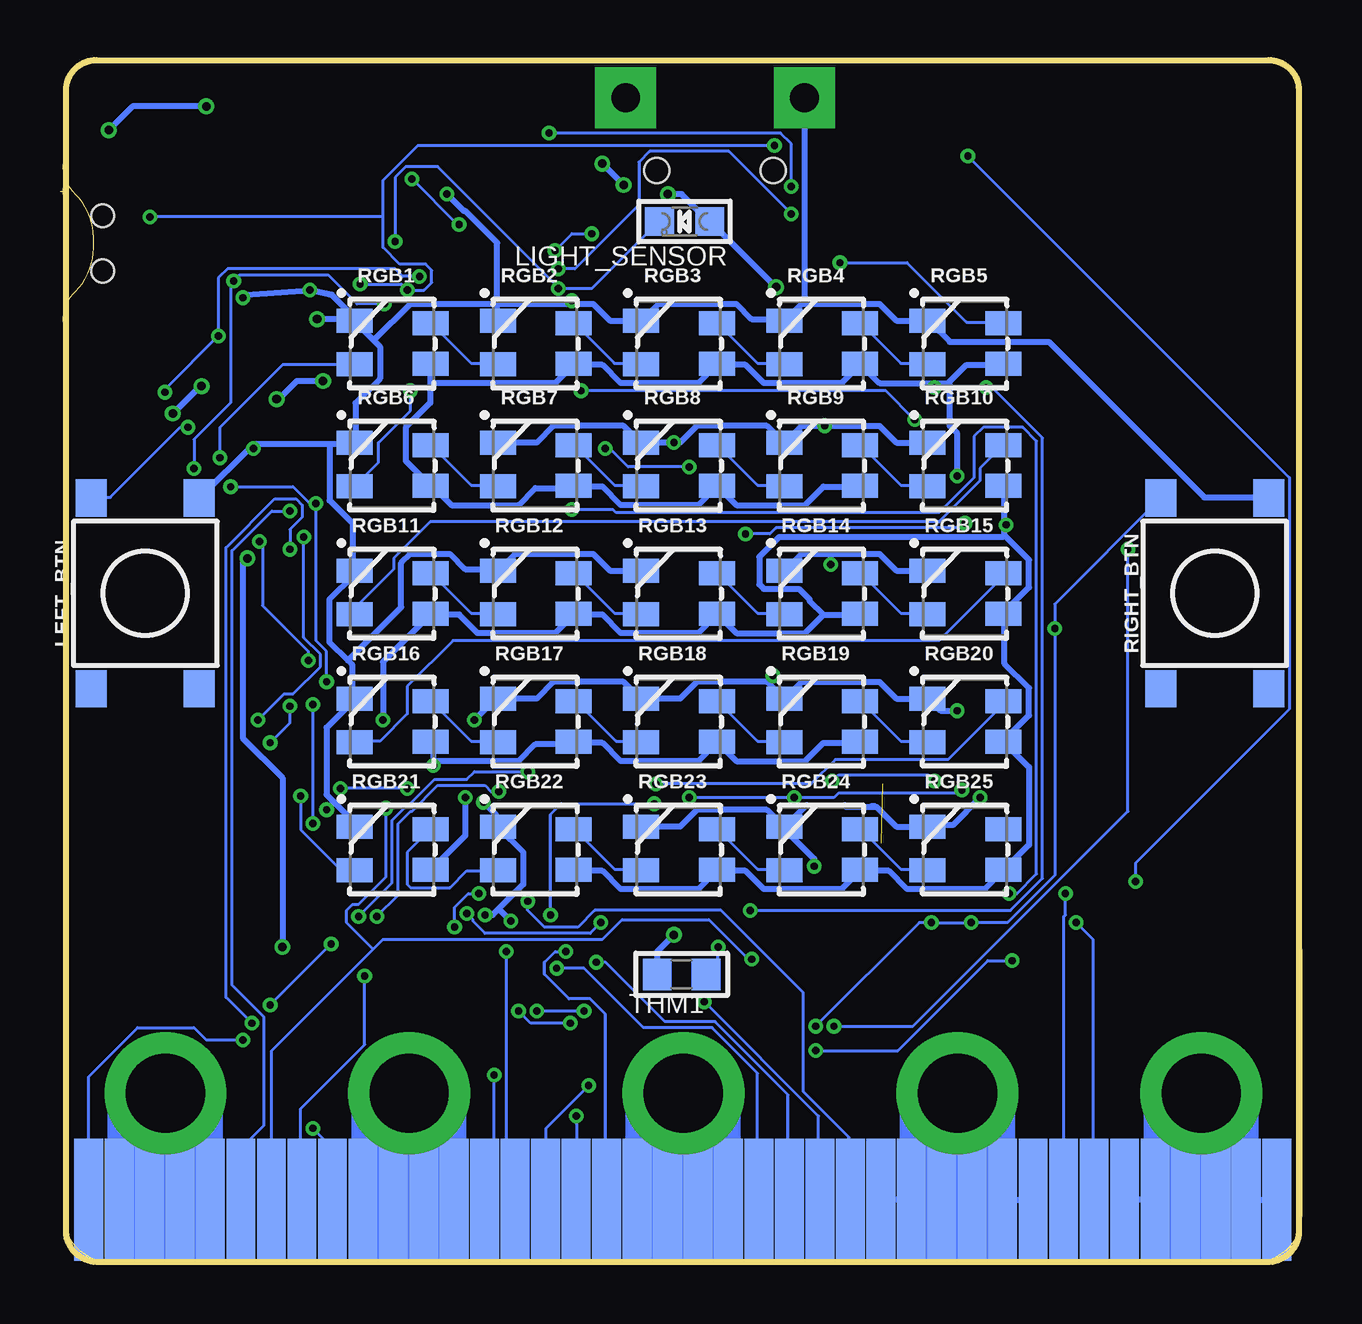
[diagram p3: board, bottom side, seen from below]

Size 51.76 x 50.11 mm. Coordinates in mm from the lower left corner, seen from the top.
Outline: 51.11,44.51 arc45 51.63,45.78 arc-45 51.11,44.51
Outline: 51.11,40.48 arc-45 51.63,39.21 arc45 51.11,40.48
Outline: 51.11,40.48 arc-45 50.36,42.27
Outline: 50.36,42.71 arc-45 51.11,44.51
Outline: 51.11,40.48 arc-45 50.36,42.27
Outline: 50.36,42.27 50.36,42.71
Outline: 50.36,42.71 arc-45 51.11,44.51
Outline: 51.76,44.65 51.5,44.65
Outline: 51.63,44.52 51.63,44.78
Outline: 50.23,50.11 1.39,50.11 arc90 0.12,48.84 0.12,1.29 arc90 1.47,0.02 50.11,0.02 arc90 51.5,1.29 51.5,48.84 arc90 50.23,50.11
Copper layers (1*16): Top 0.035mm / dielectric 1.5mm / Bottom 0.035mm
Design rules "SeeedStudio_rule_no_angle_090911 *": minimum track width 5mil, minimum drill 12mil, track to track 5mil, track to pad 5mil, pad to pad 5mil, via to via 5mil, smd to smd 0mil, copper to edge 6mil, drill to drill 6mil, minimum pad ring 8mil, minimum via ring 6mil, stop-mask expansion 2mil, vias tented up to drill 100mil, thermal gap 8mil
tRestrict: area 45.5,17.2 to 51.1,30.8
bRestrict: area 45.5,17.2 to 51.1,30.8

### Footprints (pad centres in the part's own frame; a part is rotated, then mirrored left to right if it is on the bottom)
_0603 = smd 0.9 x 0.8: 1 -0.762,0; 2 0.762,0
C0805 = smd 1.016 x 1.397: 1 -0.889,0; 2 0.889,0
LED-0603 = smd 1 x 1: A -0.877,0; C 0.877,0
SOD123 = smd 1.4 x 1.4: A 1.9,0; C -1.9,0
SOD-123 = smd 1.4 x 1.4: A 1.85,0; C -1.85,0
FIDUCIAL-1X2 = smd 1 x 1: 1 0,0
SOT23-6 = smd 0.55 x 1.2: 1 -0.95,-1.3; 2 0,-1.3; 3 0.95,-1.3; 4 0.95,1.3; 5 0,1.3; 6 -0.95,1.3
LGA16_3X3MM = smd 0.8 x 0.25: 1 -1.45,1; 2 -1.45,0.5; 3 -1.45,0; 4 -1.45,-0.5; 5 -1.45,-1; 9 1.45,-1; 10 1.45,-0.5; 11 1.45,0; 12 1.45,0.5; 13 1.45,1 | smd 0.25 x 0.8: 6 -0.5,-1.45; 7 0,-1.45; 8 0.5,-1.45; 14 0.5,1.45; 15 0,1.45; 16 -0.5,1.45
SD32-4R7MC = smd 1.75 x 3: 1 -1.375,0; 2 1.375,0
TACTILE_SWITCH_SMD_6.2MM_TALL = smd 1.55 x 1.3: A1 -3.975,-2.25; A2 3.975,-2.25; B1 -3.975,2.25; B2 3.975,2.25
CHIPLED_0805 = smd 1.2 x 1.2: A 0,-1.05; C 0,1.05
MICROBIT_PAD_SMALL = drill 3.302 pad 5.08: PAD -0.076,0
4P-SMD-7X3.5X3.5H = smd 1.143 x 1.524: 1 -2.159,1.524; 2 2.159,1.524 | smd 1.778 x 1.016: S1 -3.556,-0.508; S2 3.556,-0.508 | hole 0.95: -1.15,0; 1.15,0
WS2812B-3535 = smd 1.5 x 1: 1 1.855,-0.6; 2 1.855,1.1; 3 -1.304,1.2; 4 -1.304,-0.616
BUZZER_SMT_7.5MM = smd 2 x 2: + 2.8,-2.8; - 2.8,2.8; MT2 -2.8,2.8 | smd 2 x 1 rotated 135: MT -3,-3
R0805 = smd 1.2 x 1.3: 1 -1.016,0; 2 1.016,0
TP_3535 = smd 0.889 x 0.889: T 0,0
ESP-WROOM-32 = smd 0.9 x 1.5: 1 7.7,9; 2 6.43,9; 3 5.16,9; 4 3.89,9; 5 2.62,9; 6 1.35,9; 7 0.08,9; 8 -1.19,9; 9 -2.46,9; 10 -3.73,9; 11 -5,9; 12 -6.27,9; 13 -7.54,9; 14 -8.81,9; 25 -8.81,-9; 26 -7.54,-9; 27 -6.27,-9; 28 -5,-9; 29 -3.73,-9; 30 -2.46,-9; 31 -1.19,-9; 32 0.08,-9; 33 1.35,-9; 34 2.62,-9; 35 3.89,-9; 36 5.16,-9; 37 6.43,-9; 38 7.7,-9 | smd 1.5 x 0.9: 15 -10.3,5.715; 16 -10.3,4.445; 17 -10.3,3.175; 18 -10.3,1.905; 19 -10.3,0.635; 20 -10.3,-0.635; 21 -10.3,-1.905; 22 -10.3,-3.175; 23 -10.3,-4.445; 24 -10.3,-5.715 | smd 6 x 6: GND 0,0
SOT23-5 = smd 0.55 x 1.2: 1 -0.95,-1.3; 2 0,-1.3; 3 0.95,-1.3; 4 0.95,1.3; 5 -0.95,1.3
QFN-44 = smd 0.8 x 0.3: 1 -3.4,2.5; 2 -3.4,2; 3 -3.4,1.5; 4 -3.4,1; 5 -3.4,0.5; 6 -3.4,0; 7 -3.4,-0.5; 8 -3.4,-1; 9 -3.4,-1.5; 10 -3.4,-2; 11 -3.4,-2.5; 23 3.4,-2.5; 24 3.4,-2; 25 3.4,-1.5; 26 3.4,-1; 27 3.4,-0.5; 28 3.4,0; 29 3.4,0.5; 30 3.4,1; 31 3.4,1.5; 32 3.4,2; 33 3.4,2.5 | smd 0.3 x 0.8: 12 -2.5,-3.4; 13 -2,-3.4; 14 -1.5,-3.4; 15 -1,-3.4; 16 -0.5,-3.4; 17 0,-3.4; 18 0.5,-3.4; 19 1,-3.4; 20 1.5,-3.4; 21 2,-3.4; 22 2.5,-3.4; 34 2.5,3.4; 35 2,3.4; 36 1.5,3.4; 37 1,3.4; 38 0.5,3.4; 39 0,3.4; 40 -0.5,3.4; 41 -1,3.4; 42 -1.5,3.4; 43 -2,3.4; 44 -2.5,3.4
BBC_EDGE = smd 1.2 x 5.08: P$1 -50.215,2.673; P$2 -48.945,2.673; P$3 -47.675,2.673; P$4 -46.405,2.673; P$5 -45.135,2.673; P$6 -43.865,2.673; P$7 -42.595,2.673; P$8 -41.325,2.673; P$9 -40.055,2.673; P$10 -38.785,2.673; P$11 -37.515,2.673; P$12 -36.245,2.673; P$13 -34.975,2.673; P$14 -33.705,2.673; P$15 -32.435,2.673; P$16 -31.165,2.673; P$17 -29.895,2.673; P$18 -28.625,2.673; P$19 -27.355,2.673; P$20 -26.085,2.673; P$21 -24.815,2.673; P$22 -23.545,2.673; P$23 -22.275,2.673; P$24 -21.005,2.673; P$25 -19.735,2.673; P$26 -18.465,2.673; P$27 -17.195,2.673; P$28 -15.925,2.673; P$29 -14.655,2.673; P$30 -13.385,2.673; P$31 -12.115,2.673; P$32 -10.845,2.673; P$33 -9.575,2.673; P$34 -8.305,2.673; P$35 -7.035,2.673; P$36 -5.765,2.673; P$37 -4.495,2.673; P$38 -3.225,2.673; P$39 -1.955,2.673; P$40 -0.685,2.673 | smd 1.2 x 5.08 bottom: P$41 -0.685,2.673; P$42 -1.955,2.673; P$43 -3.225,2.673; P$44 -4.495,2.673; P$45 -5.765,2.673; P$46 -7.035,2.673; P$47 -8.305,2.673; P$48 -9.575,2.673; P$49 -10.845,2.673; P$50 -12.115,2.673; P$51 -13.385,2.673; P$52 -14.655,2.673; P$53 -15.925,2.673; P$54 -17.195,2.673; P$55 -18.465,2.673; P$56 -19.735,2.673; P$57 -21.005,2.673; P$58 -22.275,2.673; P$59 -23.545,2.673; P$60 -24.815,2.673; P$61 -26.085,2.673; P$62 -27.355,2.673; P$63 -28.625,2.673; P$64 -29.895,2.673; P$65 -31.165,2.673; P$66 -32.435,2.673; P$67 -33.705,2.673; P$68 -34.975,2.673; P$69 -36.245,2.673; P$70 -37.515,2.673; P$71 -38.785,2.673; P$72 -40.055,2.673; P$73 -41.325,2.673; P$74 -42.595,2.673; P$75 -43.865,2.673; P$76 -45.135,2.673; P$77 -46.405,2.673; P$78 -47.675,2.673; P$79 -48.945,2.673; P$80 -50.215,2.673
MICRO-USB = smd 0.4 x 1.75: 1 -1.3,4.525; 2 -0.65,4.525; 3 0,4.525; 4 0.65,4.525; 5 1.3,4.525 | drill 1.2 pad 2.54 square: GND1 -3.725,1.7; GND2 3.725,1.7 | hole 1.05: -2.425,4.73; 2.425,4.73
SOT-23-6 = smd 1 x 0.55: 1 -1.35,0.95; 2 -1.35,0; 3 -1.35,-0.95; 4 1.35,-0.95; 5 1.35,0; 6 1.35,0.95
JSTPH2 = smd 1 x 4.6: 1 -1,-3.7; 2 1,-3.7 | smd 1.6 x 3.4: NC1 -3.4,1.5; NC2 3.4,1.5
RESONATOR-SMD-3.2X1.3 = smd 0.45 x 1.905: 1 -1.2,0; 2 0,0; 3 1.2,0

### Placement (x,y rotation side)
C1  15.31,32.71 90 top
C2  6.8,12.52 270 top
C3  13.4,23.7 270 top
C4  16.71,28.27 90 top
C5  13.4,28.27 90 top
C7  16.71,23.7 270 top
C8  20.52,23.7 270 top
C9  43.88,38.56 90 top
C11  20.52,28.27 90 top
C14  18.48,12.52 270 top
C15  4.01,41.48 180 top
C16  12.01,36.78 90 top
C17  15.69,12.52 270 top
C18  33.22,43.25 0 top
D5  32.07,12.52 90 top
D6  4.13,30.93 180 top
D9  24.58,39.44 90 top
D10  21.66,32.84 270 top
D30  7.82,42.87 90 top
FD1  1.09,44.14 270 top
FD2  50.36,48.46 270 top
FD3  1.09,8.71 270 top
FD4  50.49,9.85 270 top
FRAME1  -9.2,-3.61 0 top  (outside the outline)
IC2  5.78,17.98 270 top
IC4  18.48,18.49 180 top
L1  4.26,36.4 270 top
LEFT_BTN  48.2,27.89 90 bottom
LIGHT_SENSOR  25.72,43.38 90 bottom
PAD_3V3  14.42,7.06 0 top
PAD_GND  4.26,7.06 0 top
PAD_IO25  25.85,7.06 0 top
PAD_IO32  47.44,7.06 0 top
PAD_IO33  37.28,7.06 0 top
R1  41.34,12.77 90 top
R2  18.74,32.84 270 top
R3  4.01,12.52 90 top
R4  34.36,12.52 270 top
R5  9.85,17.98 90 top
R6  33.22,47.44 180 top
R7  25.22,12.52 90 top
R8  28.64,12.52 90 top
R9  9.72,12.52 270 top
R10  8.58,31.95 270 top
R11  10.99,31.95 90 top
R12  21.79,12.52 90 top
R13  12.9,12.52 270 top
R14  38.04,12.77 90 top
R15  30.42,38.3 270 top
R17  33.22,45.41 180 top
R18  46.04,38.56 90 top
RESET  49.98,42.47 90 top
RGB1  38.17,38.05 0 bottom
RGB2  32.2,38.05 0 bottom
RGB3  26.23,38.05 0 bottom
RGB4  20.26,38.05 0 bottom
RGB5  14.29,38.05 0 bottom
RGB6  38.17,32.97 0 bottom
RGB7  32.2,32.97 0 bottom
RGB8  26.23,32.97 0 bottom
RGB9  20.26,32.97 0 bottom
RGB10  14.29,32.97 0 bottom
RGB11  38.17,27.63 0 bottom
RGB12  32.2,27.63 0 bottom
RGB13  26.23,27.63 0 bottom
RGB14  20.26,27.63 0 bottom
RGB15  14.29,27.63 0 bottom
RGB16  38.17,22.3 0 bottom
RGB17  32.2,22.3 0 bottom
RGB18  26.23,22.3 0 bottom
RGB19  20.26,22.3 0 bottom
RGB20  14.29,22.3 0 bottom
RGB21  38.17,16.96 0 bottom
RGB22  32.2,16.96 0 bottom
RGB23  26.23,16.96 0 bottom
RGB24  20.26,16.96 0 bottom
RGB25  14.29,16.96 0 bottom
RIGHT_BTN  3.63,27.89 90 bottom
SP1  6.8,25.09 270 top
THM1  25.85,12.01 180 bottom
TP_IO0  25.85,15.7 0 top
TP_MISO  32.45,40.59 0 top
TP_MOSI  32.45,38.81 0 top
TP_RESET  34.23,38.81 0 top
TP_RX  36.01,38.81 90 top
TP_SCK  34.23,40.59 0 top
TP_TX  36.01,40.59 90 top
U1  36.01,26.11 0 top
U2  20.14,39.19 180 top
U3  42.36,45.16 0 top
U$1  51.25,-0.05 0 top
U$9  24.45,50.24 180 top
U$15  8.32,36.65 90 top
X1  14.17,46.56 0 top
Y2  40.84,38.56 180 top

### Tracks (layer width: path | path; a pad name or v marks a point on that pad's centre or on a via)
3.3V  (via drill 0.36)  (1 unrouted)
  Top 0.254: 39.82,48.59 39.82,49.1 40.33,49.6 44.39,49.6 44.9,49.1 44.9,48.84 | 44.9,48.84 44.9,48.59 U3.34 | 39.82,48.59 U3.44 | R14.1 38.74,11.31 40.65,11.31 R1.1 v42.49,13.15 | 45.98,36.4 45.79,36.2 43.12,36.2 42.49,35.57 42.49,35.13 | 45.98,36.4 46.8,37.22 46.8,38.36 46.04,39.13 R18.2 46.8,40.08 46.8,42.87 | 42.49,35.13 U1.2 | v43.95,29.35 43.95,29.6 47.06,32.71 v47.06,35.38 | v45.85,36.52 45.98,36.4 | 44.9,48.84 46.36,48.84 46.8,48.4 46.8,42.87 | R13.2 R9.2 | R13.2 12.96,11.69 12.96,8.39 14.29,7.06 PAD_3V3.PAD | 18.48,19.95 IC4.7 | IC4.13 17.09,17.47 17.53,17.47 17.91,17.09 IC4.14 18.04,17.03 IC4.15 18.55,17.03 18.93,17.03 IC4.16 | IC4.16 19.06,17.09 19.44,17.47 19.88,17.47 IC4.1 20.01,17.41 22.42,17.41 v26.17,13.66 | 18.93,16.9 IC4.16 | 17.47,19.95 16.45,19.95 14.48,17.98 14.48,13.54 12.96,12.01 12.96,11.82 R13.2 | v21.91,40.65 21.91,38.75 21.15,37.98 U2.5 21.09,37.86 21.66,37.28 D10.A 21.72,33.6 21.72,33.28 22.55,32.46 22.55,29.54 C11.1 20.52,25.98 | 20.52,25.98 C8.1 | C4.1 16.71,25.98 | 16.71,25.98 C7.1 17.47,23.7 17.47,19.95 | R5.2 9.85,20.01 12.64,22.81 12.64,23.7 C3.1 13.4,25.98 | 13.4,25.98 C5.1 | 13.4,25.98 16.71,25.98 | 16.71,25.98 20.52,25.98 | 39.82,48.59 34.8,48.59 34.74,48.65 32.01,48.65 v29.15,45.79 | v28.26,44.91 27.44,44.91 27.06,44.52 v26.42,44.52 | U3.24 46.52,43.16 46.8,42.87 | U3.14 40.84,41.73 40.84,41.09 39.77,40.03 39.6,40.03 39.01,39.44 39.01,37.79 39.08,37.72 39.08,37.6 39.9,36.78 40.75,36.78 v40.8,36.74 | v42.73,35.98 42.73,35.37 42.49,35.13 | 17.47,19.95 18.48,19.95 | IC4.8 18.47,19.94 18.48,19.95 | R12.2 21.79,13.92 18.93,16.77 IC4.16
  Bottom 0.254: U$1.P$72 U$1.P$71 U$1.P$70 U$1.P$69 U$1.P$68 U$1.P$67 17.1,2.62 | v42.49,13.15 42.49,20.2 44.14,21.86 44.14,29.16 v43.95,29.35 | v47.06,35.38 45.92,36.52 v45.85,36.52 | THM1.2 26.87,12.96 v26.17,13.66 | v21.91,40.65 24.64,43.38 LIGHT_SENSOR.A 24.77,43.44 25.85,44.52 v26.42,44.52 | v28.26,44.91 v29.15,45.79 | v40.8,36.74 41.89,36.74 42.65,35.98 v42.73,35.98
  Bottom 1.27: U$1.P$69 15.01,6.4 PAD_3V3.PAD
5V  (via drill 0.3)
  Top 0.254: 33.22,44.91 34.17,43.95 35.88,43.95 36.39,44.46 37.22,44.46 37.41,44.65 38.93,44.65 U3.7 | 33.22,44.91 33.22,47.95 33.41,48.14 34.55,48.14 35.5,47.19 38.93,47.19 U3.2 | C16.1 14.61,35.89 15.25,36.52 | 15.25,36.52 19.12,40.4 U2.3 19.25,40.52 19.25,40.84 19.75,41.35 20.52,41.35 21.02,40.84 21.02,40.52 U2.1 21.09,40.91 21.53,41.35 22.17,41.35 24.58,38.94 | 24.58,38.94 D9.C | 33.22,44.91 32.26,43.95 31.5,43.95 26.55,39 24.64,39 24.58,38.94 | v15.31,36.46 15.25,36.52 | v34.87,19.38 v36.2,20.71 36.26,20.77 36.45,20.77 v38.3,22.62 | R10.2 6.29,31.19 D6.C 6.67,31.13 6.67,29.47 6.99,29.16 | 14.36,31.95 13.4,31.95 12.26,30.81 | 14.36,31.95 C1.1 | 12.26,30.81 10.61,29.16 6.99,29.16 | IC2.5 6.74,17.98 6.23,18.49 6.23,28.39 6.99,29.16 | v12.33,30.74 12.26,30.81 | 14.36,31.95 v14.36,32.78
  Bottom 0.254: RGB9.1 18.42,32.33 19.95,32.33 20.71,31.57 23.56,31.57 24.33,32.33 RGB8.1 24.45,32.27 25.15,31.57 28.39,31.57 29.15,32.33 30.3,32.33 RGB7.1 30.42,32.27 31.95,32.27 32.64,31.57 35.44,31.57 36.2,32.33 RGB6.1 36.33,32.4 37.34,33.41 37.34,34.81 36.33,35.82 36.33,36.65 | 36.33,36.65 36.33,37.41 RGB1.1 | 14.74,36.65 13.98,37.41 12.45,37.41 RGB5.1 | 15.31,36.65 17.6,36.65 18.36,37.41 RGB4.1 18.48,37.35 19.18,36.65 22.42,36.65 23.18,37.41 24.33,37.41 RGB3.1 24.45,37.35 25.15,36.65 28.39,36.65 29.15,37.41 30.3,37.41 RGB2.1 30.42,37.35 31.12,36.65 36.33,36.65 | 15.31,36.65 14.74,36.65 | v15.31,36.46 15.31,36.65 | v34.87,19.38 34.87,17.79 36.26,16.39 RGB21.1 | RGB16.1 36.26,21.66 36.2,21.6 v36.2,20.71 36.14,20.9 32.64,20.9 31.95,21.6 30.42,21.6 RGB17.1 30.3,21.66 29.15,21.66 28.39,20.9 25.15,20.9 24.45,21.6 RGB18.1 24.33,21.66 23.56,20.9 20.71,20.9 19.95,21.66 18.42,21.66 RGB19.1 | 19.95,27 18.42,27 RGB14.1 | 19.95,27 20.71,26.24 23.56,26.24 24.33,27 RGB13.1 24.45,26.93 25.15,26.24 28.39,26.24 29.15,27 30.3,27 RGB12.1 30.42,26.93 31.12,26.24 34.36,26.24 35.12,27 36.26,27 RGB11.1 36.39,26.93 38.3,25.03 v38.3,22.62 | 12.39,30.3 12.39,30.74 | 12.39,30.74 12.39,32.33 RGB10.1 | 12.39,30.3 11.37,29.28 11.37,28.14 12.39,27.12 RGB15.1 12.39,27 12.39,24.97 11.37,23.95 11.37,22.81 12.39,21.79 RGB20.1 12.39,21.66 11.37,20.65 11.37,17.41 12.39,16.39 RGB25.1 12.52,16.27 13.21,15.57 16.45,15.57 17.21,16.33 18.36,16.33 RGB24.1 18.48,16.27 19.18,15.57 22.42,15.57 23.18,16.33 24.33,16.33 RGB23.1 24.45,16.27 25.15,15.57 28.39,15.57 29.15,16.33 30.3,16.33 RGB22.1
  Bottom 0.254: 19.95,27 20.52,27.57 20.52,27.63 20.96,28.08 22.42,28.08 22.61,28.27 22.61,29.41 21.79,30.24 12.45,30.24 12.39,30.3 | v12.33,30.74 12.39,30.74 | v14.36,32.78 14.36,34.56 14.67,34.87 14.67,36.59 14.74,36.65
32U4_MISO
  Top 0.127: TP_MISO.T 33.22,40.59 36.77,44.14 38.93,44.14 U3.8
32U4_MOSI
  Top 0.127: TP_MOSI.T 33.09,39.44 34.04,39.44 34.87,40.27 34.87,40.4 37.6,43.13 38.93,43.13 U3.10
32U4_RST  (via drill 0.3)
  Top 0.127: v39.25,40.78 39.76,40.78 40.36,41.38 U3.13 | v37.28,40.52 36.9,40.52 36.07,39.7 35.12,39.7 TP_RESET.T | R9.1 9.53,13.28 v6.93,15.89 | v13.91,46.11 21.53,46.11 v21.98,46.56 | RESET.2 48.46,44.02 v48.01,43.57
  Bottom 0.127: v39.25,40.78 37.53,40.78 v37.28,40.52 36.58,40.52 36.26,40.84 36.26,41.35 36.52,41.6 37.6,41.6 38.3,42.3 38.3,43.57 | v6.93,15.89 6.93,16.65 0.51,23.06 0.51,32.71 v13.91,46.11 | v21.98,46.56 36.84,46.56 38.3,45.09 38.3,43.57 | 38.3,43.57 v48.01,43.57
32U4_SCK
  Top 0.127: TP_SCK.T 37.28,43.64 38.93,43.64 U3.9
D+
  Top 0.127: R17.1 34.68,46.11 38.93,46.11 U3.4
D-
  Top 0.127: R6.1 34.74,46.68 38.93,46.68 U3.3
ESP_RST
  Top 0.127: C9.1 43,38.68 43,40.21 43.31,40.52 43.31,41.73 U3.19 | C9.1 R18.1 | U1.3 41.22,35.13 41.22,35.82 43.49,38.09 C9.1
FB1
  Top 0.127: R11.2 9.28,32.71 | 9.28,32.71 R10.1 | 9.28,32.71 9.28,35.25 U$15.3
GND  (via drill 0.3, 0.36)
  Top 0.254: 11.25,37.67 10.48,37.67 8.39,35.57 8.39,35.38 U$15.2 8.32,35.06 7.88,34.62 7.88,32.14 8.07,31.95 9.09,31.95 9.85,31.19 R11.1 11.05,31.25 11.44,31.25 15.88,35.7 16.39,35.7 16.71,35.38 16.71,33.47 | 11.25,37.67 C16.2 | C15.2 3.37,41.48 4.7,42.81 11.25,42.81 | 11.25,42.81 13.15,42.81 X1.1 | 11.25,42.81 11.25,37.67 | 16.01,29.03 C4.2 19.63,29.03 | 16.01,29.03 C5.2 | 19.63,29.03 C11.2 | 16.71,33.47 18.61,33.47 R2.1 19.95,34.81 | 16.71,33.47 16.01,33.47 | 16.01,33.47 C1.2 | U2.2 20.14,35 19.95,34.81 | 16.01,33.47 16.01,29.03 | v19.63,29.09 19.63,29.03 | v19.88,34.87 19.95,34.81 | 16.39,12.46 16.39,13.85 16.26,13.98 16.26,17.73 16.58,18.04 17.02,18.04 IC4.12 17.15,18.04 17.53,18.04 17.72,18.23 17.72,18.74 | C17.2 16.39,12.46 | 16.39,12.46 17.09,11.76 C14.2 19.56,10.68 22.49,10.68 23.56,11.76 | 23.56,11.76 R7.1 | 19.88,19.44 IC4.5 19.75,19.44 19.37,19.44 18.74,18.81 17.79,18.81 17.72,18.74 | C7.2 14.36,22.93 | 14.36,22.93 C3.2 13.34,22.87 13.34,19.44 | PAD_GND.PAD 4.13,7.06 3.31,7.88 3.31,17.09 4.2,17.98 IC2.2 4.58,17.92 4.9,17.92 6.36,16.46 10.36,16.46 13.34,19.44 | v13.4,19.38 13.34,19.44 | v20.33,16.52 23.5,13.35 23.5,11.82 23.56,11.76 | 34.11,22.62 34.11,24.2 U1.GND | 34.11,22.62 v34.11,19.19 | C18.1 31.38,43.25 30.42,42.3 v30.42,40.08 R15.1 30.36,39 29.47,39 26.1,35.63 26.1,34.17 | C8.2 20.52,23.12 21.91,24.52 | 21.91,24.52 24.64,27.25 24.64,31.06 25.41,31.82 U1.15 25.79,31.89 26.1,32.2 26.1,34.17 | v22.04,24.46 21.98,24.46 21.91,24.52 | v34.49,22.62 34.11,22.62 | v14.36,23 14.36,22.93 | v26.17,34.17 26.1,34.17 | U$9.GND2 20.77,48.59 23.12,46.24 23.12,45.73 U$9.5 23.06,46.43 25.15,48.52 28.14,48.52 U$9.GND1
  Top 0.254: v40.65,18.87 42.3,18.87 43.69,17.47 43.69,17.16 U1.38 | 48.46,38.94 RESET.1 48.39,40.4 47.44,41.35 47.44,45.35 48.08,45.98 50.49,45.98 RESET.S2 50.49,46.43 v49.73,47.19 | 48.46,38.94 48.46,38.17 45.41,35.13 43.76,35.13 U1.1 43.69,35 v43.69,33.92 | 48.46,38.94 50.49,38.94 RESET.S1 | v35.63,44.52 36.84,45.73 37.34,45.73 37.41,45.67 38.93,45.67 U3.5 39.06,45.73 39.5,45.73 39.63,45.86 39.63,46.37 40.39,47.13 40.39,48.52 U3.43 | C9.2 44.46,39.89 | 44.46,39.89 45.73,41.16 45.73,42.62 U3.23 | U3.15 41.34,41.73 v41.34,40.52 41.34,40.41 | v44.14,40.21 44.46,39.89 | v41.04,39.32 40.84,39.11 Y2.2 | U3.33 45.76,47.83 | 45.76,47.83 45.76,48.08 v45.66,48.18 | 45.76,47.83 44.52,47.83 44.33,48.02 44.33,48.52 U3.35 | 17.06,19.01 IC4.10 17.15,18.93 17.53,18.93 17.72,18.74 | v32.96,14.23 32.9,14.23 32.07,13.41 D5.C
  Bottom 0.254: U$1.P$80 U$1.P$79 U$1.P$78 U$1.P$77 U$1.P$76 U$1.P$75 | RGB10.3 15.63,34.17 16.9,34.17 17.6,34.87 v19.88,34.87 20.83,34.87 21.53,34.17 RGB9.3 21.66,34.24 22.29,34.87 25.22,34.87 25.91,34.17 v26.17,34.17 27.5,34.17 RGB8.3 27.63,34.24 28.26,34.87 31.18,34.87 31.88,34.17 33.47,34.17 RGB7.3 | 19.63,29.54 20.83,29.54 21.53,28.84 RGB14.3 | 19.63,29.54 17.6,29.54 16.9,28.84 15.63,28.84 RGB15.3 | v19.63,29.09 19.63,29.54 | RGB24.3 21.53,18.17 20.64,19.06 19.06,19.06 18.99,19 17.98,19 | 17.98,19 17.72,19 16.9,18.17 15.63,18.17 RGB25.3 15.5,18.23 14.55,18.23 v13.4,19.38 | RGB23.3 27.5,18.17 25.91,18.17 25.22,18.87 22.29,18.87 21.66,18.23 RGB24.3 | v20.33,16.52 20.33,16.84 21.53,18.04 RGB24.3 | v34.04,14.49 33.72,14.49 33.47,14.74 | 33.47,14.74 32.45,15.76 32.45,17.09 33.47,18.11 RGB22.3 33.6,18.23 33.6,18.68 v34.11,19.19 | 22.29,24.2 25.22,24.2 25.91,23.51 27.5,23.51 RGB18.3 27.63,23.57 28.26,24.2 31.18,24.2 31.88,23.51 33.47,23.51 RGB17.3 33.6,23.51 v34.49,22.62 | 22.29,24.2 21.66,23.57 RGB19.3 21.53,23.51 20.83,24.2 17.6,24.2 16.9,23.51 15.63,23.51 RGB20.3 15.5,23.44 15.06,23 v14.36,23 | v22.04,24.46 22.29,24.2 | 20.71,39.95 20.83,39.95 21.53,39.25 RGB4.3 21.66,39.32 22.93,39.32 23.56,39.95 26.8,39.95 27.44,39.32 RGB3.3 27.56,39.25 28.83,39.25 29.53,39.95 30.42,39.95 | 20.71,39.95 17.6,39.95 16.9,39.25 15.63,39.25 RGB5.3 15.5,39.19 14.67,38.36 10.55,38.36 4.07,31.89 1.4,31.89 RIGHT_BTN.A2 | 20.71,39.95 20.71,48.52 U$9.GND2 | RGB13.3 27.56,28.84 28.83,28.84 29.53,29.54 32.77,29.54 33.47,28.84 RGB12.3 33.6,28.9 34.87,28.9 35.5,29.54 37.15,29.54 37.53,29.16 37.53,27.32 39.76,25.09
  Bottom 0.254: 40.33,19.19 40.65,19.5 40.65,22.3 39.5,23.44 RGB16.3 39.57,23.57 39.57,24.9 39.76,25.09 | 40.33,19.19 39.5,18.36 39.5,18.17 RGB21.3 | 39.76,25.09 40.52,25.86 40.52,27.63 39.5,28.65 39.5,28.78 RGB11.3 39.57,28.9 39.57,30.81 40.52,31.76 40.52,34.11 | 40.33,19.19 v40.65,18.87 | v35.63,44.52 34.93,43.83 34.87,43.83 33.53,42.49 33.53,39.95 | 33.53,39.95 33.53,39.25 RGB2.3 | 33.53,39.95 30.42,39.95 | 39.44,39.19 38.68,38.43 | 38.68,38.43 38.42,38.17 38.42,36.84 39.44,35.82 39.44,34.17 RGB6.3 39.57,34.11 40.52,34.11 | 39.44,39.19 RGB1.3 | RGB1.3 39.66,39.56 40.43,40.33 v41.34,40.52 | 43.76,34.05 43.69,34.11 40.52,34.11 | 43.76,34.05 45.92,31.89 LEFT_BTN.A2 | v44.14,40.21 44.01,40.33 v41.34,40.52 | 40.52,40.33 v41.34,40.52 | 33.53,39.95 37.15,39.95 38.68,38.43 | v43.69,33.92 43.69,33.98 43.76,34.05 | v30.42,40.08 30.42,39.95 | RGB1.3 39.54,39.32 v41.04,39.32 | v45.66,48.18 48.74,48.18 v49.73,47.19 | RGB1.3 39.5,39.25 39.44,39.19 | 17.77,19.01 17.96,19.01 17.98,19 | 33.47,14.74 v32.96,14.23
  Bottom 1.27: U$1.P$77 4.85,6.4 PAD_GND.PAD
  pour Bottom (isolate 0.254, rank 6): 55.06,-2.59 59,-2.59 59,50.75 55.06,50.75
  pour Top (isolate 0.254, rank 6): 54.3,-2.59 60.65,-2.59 60.65,50.75 54.3,50.75
IO0
  Top 0.127: TP_IO0.T 27.25,17.09 U1.25
IO2  (via drill 0.3)
  Top 0.127: v26.99,19.12 25.72,20.39 U1.24 | v31.31,14.49 31.31,13.6 v30.68,12.96
  Bottom 0.127: v26.99,19.12 30.87,19.12 31.31,18.68 v31.31,14.49 | v30.68,12.96 31.12,12.96 31.57,12.52 31.57,12.01 30.55,11 29.66,11 29.03,10.36 29.03,2.68 U$1.P$58
IO4
  Top 0.127: R8.2 28.64,16.96 28.52,17.09 U1.26
IO5  (via drill 0.3)
  Top 0.127: v32.26,15.06 32.26,17.09 U1.29
  Bottom 0.127: v32.26,15.06 32.26,14.68 31.57,13.98 30.17,13.98 29.47,14.68 24.2,14.68 20.77,11.25 20.77,7.12 18.87,5.22 18.87,2.68 U$1.P$66
IO12  (via drill 0.3)
  Top 0.127: v33.47,19.63 32.77,20.33 32.77,24.08 27.25,29.6 27.25,35.06 U1.14 | v38.55,14.43 38.55,14.17 39.06,13.66 v39.06,11.95
  Bottom 0.127: v33.47,19.63 33.79,19.63 34.04,19.89 36.01,19.89 37.09,18.81 37.15,18.81 37.66,18.3 37.66,15.31 v38.55,14.43 | v39.06,11.95 39.06,9.09 41.73,6.42 41.73,2.68 U$1.P$48
IO13  (via drill 0.3)
  Top 0.127: U1.16 25.91,30.55 32.26,24.2 v32.26,20.46 | v40.46,13.28 v39.31,14.43 | v43,10.74 43.76,10.74 44.27,10.23 44.27,9.41 v44.14,9.28
  Bottom 0.127: v32.26,20.46 34.49,20.46 34.8,20.14 36.14,20.14 37.22,19.06 37.28,19.06 37.92,18.43 37.92,15.82 v39.31,14.43 | v43,10.74 v40.46,13.28 | v44.14,9.28 45.66,9.28 46.17,9.79 48.52,9.79 50.55,7.76 50.55,2.68 U$1.P$41
IO14  (via drill 0.3)
  Top 0.127: v42.17,23.19 42.17,26.24 39.06,29.35 31.69,29.35 28.52,32.52 28.52,35.06 U1.13 | v43,21.66 43,19.76 44.65,18.11 44.65,9.03 v41.22,5.6
  Bottom 0.127: v42.17,23.19 42.17,22.49 v43,21.66 | v41.22,5.6 40.46,4.84 40.46,2.68 U$1.P$49
IO16  (via drill 0.3)
  Top 0.127: v33.66,7.82 30.55,10.93 30.55,12.14 29.79,12.9 29.79,17.09 U1.27
  Bottom 0.127: v33.66,7.82 33.66,3.06 34.04,2.68 U$1.P$54
IO17  (via drill 0.3)
  Top 0.127: U1.28 31.06,17.09 31.06,15.5 32.01,14.55 32.52,14.55 32.71,14.74 33.22,14.74 33.47,14.49 33.47,13.28 v33.15,12.96
  Bottom 0.127: v33.15,12.96 33.15,3 32.84,2.68 U$1.P$55
IO18  (via drill 0.3)
  Top 0.127: 33.53,17.09 U1.30 33.53,17.03 33.53,16.14 v34.3,15.38 | v31.06,12.27 31.18,12.39 33.34,12.39 34.23,13.28 R4.1 35.06,13.98 v35.31,13.98
  Bottom 0.127: v31.06,12.27 29.91,12.27 27.44,9.79 24.58,9.79 22.68,7.88 22.68,2.68 U$1.P$63 | v34.3,15.38 34.74,15.38 35.31,14.81 v35.31,13.98
IO19  (via drill 0.3)
  Top 0.127: v34.8,14.55 34.8,17.09 U1.31 | v29.22,14.17 29.22,13.85 29.41,13.66 v29.41,12.52
  Bottom 0.127: v34.8,14.55 34.55,14.3 34.55,14.23 34.04,13.73 29.66,13.73 v29.22,14.17 | v29.41,12.52 29.03,12.52 26.55,10.04 24.45,10.04 21.41,6.99 21.41,2.68 U$1.P$64
IO23  (via drill 0.3)
  Top 0.127: v32.64,10.49 41.09,10.49 43.12,12.52 43.12,13.41 42.49,14.04 42.49,17.09 U1.37 | v30.49,9.98 29.34,9.98 28.45,10.87 v24.9,10.87
  Bottom 0.127: v32.64,10.49 32.14,9.98 v30.49,9.98 | v24.9,10.87 20.14,6.11 20.14,2.68 U$1.P$65
IO25  (via drill 0.3)
  Top 0.127: C2.1 8.58,13.28 9.28,12.58 v12.07,12.58 12.2,12.71 v12.2,15.38 | v20.26,8.84 23.95,8.84 25.72,7.06 PAD_IO25.PAD | v30.42,31.38 32.26,33.22 32.26,35.06 U1.10
  Bottom 0.127: v12.07,12.58 13.09,12.58 16.83,8.84 v20.26,8.84 | v30.42,31.38 28.71,31.38 28.58,31.25 15.12,31.25 13.66,32.71 13.66,34.43 13.28,34.81 11.63,34.81 11.05,34.24 11.05,16.2 11.88,15.38 v12.2,15.38
  Bottom 0.254: U$1.P$62 U$1.P$61 U$1.P$60 U$1.P$59
  Bottom 1.27: U$1.P$60 26.44,6.4 PAD_IO25.PAD
IO26  (via drill 0.3)
  Top 0.127: v30.04,36.33 30.99,35.38 30.99,35.13 U1.11 | v16.13,35.13 15.82,35.13 11.63,30.93 11.63,30.68 10.67,29.73 v7.25,29.73 | v19.5,9.85 20.01,9.35 24.14,9.35 24.58,9.79 27.31,9.79 v29.72,7.38
  Bottom 0.127: v30.04,36.33 17.34,36.33 v16.13,35.13 | v7.25,29.73 7.25,18.81 16.2,9.85 v19.5,9.85 | v29.72,7.38 31.5,5.6 31.5,2.68 U$1.P$56
IO27  (via drill 0.3)
  Top 0.127: v13.79,14.17 R13.1 | v15.44,14.17 15.44,13.54 C17.1 | v29.03,33.92 29.72,34.62 29.72,35.06 U1.12 | v25.53,33.16 23.18,30.81 v23.18,30.36 | v14.04,30.81 10.8,27.57 10.8,26.81 10.42,26.43 v10.29,26.43 | v30.23,6.11 30.23,7.63 27.82,10.04 20.45,10.04 v20.26,9.85
  Bottom 0.127: v29.03,33.92 28.83,33.92 28.07,33.16 v25.53,33.16 | v23.18,30.36 22.17,30.36 21.91,30.62 14.23,30.62 v14.04,30.81 | RIGHT_BTN.B2 5.91,31.82 10.29,27.44 v10.29,26.43 10.29,16.14 12.26,14.17 v13.79,14.17 v15.44,14.17 15.94,14.17 v20.26,9.85 | v30.23,6.11 30.23,2.68 U$1.P$57
IO32  (via drill 0.3)
  Top 0.127: v41.6,30.24 39.44,30.24 34.87,34.81 34.87,35.06 U1.8 | v43.5,22.62 43.5,19.63 45.35,17.79 45.35,9.03 47.31,7.06 PAD_IO32.PAD
  Bottom 0.127: v41.6,30.24 41.6,26.05 40.9,25.35 40.9,24.84 42.04,23.7 42.42,23.7 v43.5,22.62
  Bottom 0.254: U$1.P$45 U$1.P$44 U$1.P$43 U$1.P$42
  Bottom 1.27: 47.19,5.34 47.23,5.34 47.36,5.48 PAD_IO32.PAD 48.03,6.4 U$1.P$43
IO33  (via drill 0.3)
  Top 0.127: IC4.11 16.52,18.49 14.93,16.9 14.93,11.38 15.94,10.36 28.58,10.36 31.63,7.31 36.9,7.31 37.15,7.06 PAD_IO33.PAD 38.42,7.06 41.34,9.98 v43.76,9.98 | v42.17,29.73 38.68,29.73 33.6,34.81 33.6,35.06 U1.9
  Bottom 0.127: v42.17,29.73 42.17,30.55 41.66,31.06 41.66,31.57 41.92,31.82 42.8,31.82 44.84,29.79 44.84,11.06 v43.76,9.98
  Bottom 0.254: U$1.P$53 U$1.P$52 U$1.P$51 U$1.P$50 | 37.24,7.02 PAD_IO33.PAD
  Bottom 1.27: U$1.P$51 37.87,6.4 37.24,7.02
IO34  (via drill 0.3)
  Top 0.127: R7.2 24.45,13.28 v24.33,13.15 24.39,13.28 v22.99,14.68 | v30.99,41.41 31.5,40.91 31.5,38.43 32.01,37.92 34.8,37.92 37.34,35.38 37.34,35.13 U1.6 | v21.28,43.7 20.39,43.7 v13.15,36.46
  Bottom 0.127: v24.33,13.15 24.33,12.52 THM1.1 | v30.99,41.41 30.3,41.41 27.63,44.08 27.63,45.86 27.18,46.3 23.88,46.3 v21.28,43.7 | v13.15,36.46 12.9,36.46 10.8,34.36 10.8,16.01 12.13,14.68 v22.99,14.68
IO35  (via drill 0.3)
  Top 0.127: v41.09,31.63 39.31,31.63 36.14,34.81 36.14,35.06 U1.7 | v44.65,32.33 46.42,34.11 v46.42,34.81 | v40.65,24.2 40.65,23.82 38.17,21.35 v38.17,18.93 | C14.1 20.26,13.28 R12.1 21.79,11.82 22.1,11.82 v22.93,12.65
  Bottom 0.127: v44.65,32.33 42.04,32.33 41.34,31.63 v41.09,31.63 41.09,25.92 40.65,25.47 v40.65,24.2 | v46.42,34.81 46.74,34.81 49.66,31.89 50.42,31.89 LEFT_BTN.B2 | v22.93,12.65 23.06,12.65 24.71,14.3 28.33,14.3 29.15,13.47 38.3,13.47 38.71,13.06 | 38.71,13.06 42.93,8.84 42.93,2.68 U$1.P$47 | v38.17,18.93 38.17,16.08 39.31,14.93 39.57,14.93 39.82,14.68 39.82,14.17 38.71,13.06
IO36  (via drill 0.3)
  Top 0.127: R15.2 30.42,37.92 31.06,38.56 31.06,40.52 v30.99,40.59 | v37.79,42.56 37.79,40.27 36.96,39.44 35.69,39.44 35.38,39.13 35.38,38.49 35.69,38.17 37.09,38.17 39.88,35.38 39.88,35.13 U1.4
  Bottom 0.127: 30.93,40.59 29.6,40.59 26.8,43.38 LIGHT_SENSOR.C | v37.79,42.56 37.79,45.22 37.34,45.67 36.01,45.67 30.93,40.59 | 30.93,40.59 v30.99,40.59
IO39  (via drill 0.3)
  Top 0.127: v42.17,31.32 38.68,34.81 38.68,35.06 U1.5
  Bottom 0.127: v42.17,31.32 42.93,31.32 44.58,29.67 44.58,11.57 43.25,10.23 43.25,5.73 44.2,4.77 44.2,2.68 U$1.P$46
N$1
  Top 0.127: D30.A 7.82,44.78 12.01,44.78 12.58,45.35 13.79,45.35 15.12,44.02 15.12,42.87 X1.2
N$2
  Top 0.127: R4.2 32.14,11.76 32.07,11.69 D5.A
N$4
  Top 0.127: R2.2 21.6,32.08 21.66,32.02 D10.C
N$5
  Top 0.127: Y2.3 39.64,39.32 40.29,39.97 41.85,39.97 41.85,41.73 U3.16
N$6
  Top 0.127: C2.2 R3.1
N$9
  Top 0.127: R3.2 4.01,16.58 4.45,17.03 IC2.3
N$10
  Top 0.127: IC2.6 7.12,18.93 7.12,19.76 9.59,22.23 SP1.-
N$11
  Top 0.127: IC2.1 4.45,18.93 4.45,21.79 4.01,22.23 SP1.+
N$13  (via drill 0.3)
  Top 0.127: R6.2 31.76,47.44 v31.38,47.06 | v21.28,44.84 21.66,44.84 21.91,44.59 24.71,44.59 25.09,44.97 25.09,45.67 U$9.2
  Bottom 0.127: v31.38,47.06 21.72,47.06 21.28,46.62 v21.28,44.84
N$14
  Bottom 0.127: RGB2.4 33.53,37.48 34.61,37.48 36.26,39.13 RGB1.2
N$15
  Bottom 0.127: RGB3.4 27.56,37.48 28.64,37.48 30.3,39.13 RGB2.2
N$16
  Top 0.127: 42.36,42.11 U3.17 42.36,39.31 42.35,39.29 42.35,38.87 Y2.1
N$17
  Bottom 0.127: RGB4.4 21.6,37.48 22.68,37.48 24.33,39.13 RGB3.2
N$18
  Bottom 0.127: RGB5.4 15.63,37.48 16.71,37.48 18.36,39.13 RGB4.2
N$21
  Bottom 0.127: RGB7.4 33.53,32.4 34.61,32.4 36.26,34.05 RGB6.2
N$22
  Bottom 0.127: RGB8.4 27.56,32.4 28.64,32.4 30.3,34.05 RGB7.2
N$23  (via drill 0.3)
  Top 0.127: v29.91,10.49 R8.1 | v31.88,10.49 32.39,9.98 40.96,9.98 44.39,13.41 44.39,17.98 42.49,19.89 42.49,22.36 42.93,22.81 42.93,31.38 v45.09,33.54
  Bottom 0.127: v31.88,10.49 v29.91,10.49 | v45.09,33.54 45.09,34.81 42.49,37.41 39.5,37.41 RGB1.4
N$24
  Bottom 0.127: RGB9.4 21.6,32.4 22.68,32.4 24.33,34.05 RGB8.2
N$25
  Bottom 0.127: RGB10.4 15.63,32.4 16.71,32.4 18.36,34.05 RGB9.2
N$28
  Bottom 0.127: RGB12.4 33.53,27.06 34.61,27.06 36.26,28.71 RGB11.2
N$29
  Bottom 0.127: RGB13.4 27.56,27.06 28.64,27.06 30.3,28.71 RGB12.2
N$31
  Bottom 0.127: RGB14.4 21.6,27.06 22.68,27.06 24.33,28.71 RGB13.2
N$32
  Bottom 0.127: RGB15.4 15.63,27.06 16.71,27.06 18.36,28.71 RGB14.2
N$35
  Bottom 0.127: RGB17.4 33.53,21.73 34.61,21.73 36.26,23.38 RGB16.2
N$36
  Bottom 0.127: RGB18.4 27.56,21.73 28.58,21.73 30.3,23.44 RGB17.2
N$37
  Top 0.127: R17.2 29.66,45.41 29.41,45.16 28.9,45.16 27.18,46.87 24.9,46.87 24.45,46.43 U$9.3
N$38
  Bottom 0.127: RGB19.4 21.6,21.73 22.68,21.73 24.33,23.38 RGB18.2
N$39
  Bottom 0.127: RGB20.4 15.63,21.73 16.71,21.73 18.36,23.38 RGB19.2
N$42
  Bottom 0.127: RGB22.4 33.53,16.33 34.8,16.33 35.5,15.63 37.15,15.63 37.28,15.76 37.28,17.09 36.33,18.04 RGB21.2
N$43
  Bottom 0.127: RGB23.4 27.56,16.39 28.64,16.39 30.3,18.04 RGB22.2
N$45
  Bottom 0.127: RGB24.4 21.6,16.39 22.68,16.39 24.33,18.04 RGB23.2
N$46
  Bottom 0.127: RGB25.4 15.63,16.39 16.71,16.39 18.36,18.04 RGB24.2
OUT1  (via drill 0.3)
  Top 0.127: v19.25,41.67 22.42,41.67 23.82,40.27 26.99,40.27 v29.6,42.87 | v31.12,42.17 31.12,42.05 31.82,41.35 31.82,38.49 32.14,38.17 35.31,38.17 v37.15,36.33
  Bottom 0.127: v19.25,41.67 16.45,41.67 13.98,39.19 12.45,39.19 RGB5.2 | v29.6,42.87 30.42,42.87 v31.12,42.17 | v37.15,36.33 37.15,35.51 38.49,34.17 38.49,33.35 39.44,32.4 RGB6.4
OUT2
  Bottom 0.127: RGB11.4 39.44,27.06 39.44,27.32 37.85,28.9 37.85,29.35 36.33,30.87 15.12,30.87 13.4,32.59 13.4,33.09 12.45,34.05 RGB10.2
OUT3
  Bottom 0.127: RGB16.4 39.44,21.73 38.42,21.73 37.28,22.87 37.28,24.01 35.38,25.92 15.12,25.92 12.45,28.59 12.45,28.71 RGB15.2
OUT4  (via drill 0.3)
  Top 0.127: v41.73,19.44 40.39,19.44 v40.07,19.76 | v37.28,19.76 36.01,19.76 34.93,18.68 28.2,18.68 v26.93,19.95
  Bottom 0.127: v41.73,19.44 41.73,18.04 40.07,16.39 39.5,16.39 RGB21.4 | v37.28,19.76 v40.07,19.76 | v26.93,19.95 20.45,19.95 19.44,20.96 14.74,20.96 12.45,23.25 12.45,23.38 RGB20.2
RXI_ESP  (via drill 0.3)
  Top 0.127: v44.52,40.91 44.39,41.03 44.39,41.73 U3.21 | v38.23,39.95 37.85,39.95 36.71,38.81 TP_RX.T | v41.41,25.09 41.41,24.2 38.68,21.47 38.68,17.16 U1.34 | v43.44,30.05 43.44,30.36 v46.17,33.09
  Bottom 0.127: v38.23,39.95 39.38,39.95 40.58,41.16 44.27,41.16 v44.52,40.91 44.65,40.78 44.65,35.82 46.17,34.3 v46.17,33.09 | v41.41,25.09 41.41,25.47 43.31,27.38 43.31,29.92 v43.44,30.05
SCL_22  (via drill 0.3)
  Top 0.127: R1.2 41.34,16.96 41.22,17.09 U1.36 41.22,17.16 v41.22,18.3 | v21.15,19.38 20.77,19 IC4.4 | v14.17,19.7 14.17,19.38 10.17,15.38 v9.85,15.38 | v41.22,23.25 41.22,23.63 41.92,24.33 41.92,25.35 41.66,25.6 41.15,25.6 39.25,23.7 39.25,22.81 37.79,21.35 37.79,19.5 36.71,18.43 26.49,18.43 v25.53,19.38
  Bottom 0.127: v14.17,19.7 14.29,19.57 19.31,19.57 19.5,19.38 v21.15,19.38 v25.53,19.38 | v9.85,15.38 9.85,14.49 9.91,14.43 9.91,2.68 U$1.P$73 | v41.22,23.25 v41.22,18.3
SDA_21  (via drill 0.3)
  Top 0.127: 19.56,19.89 24.26,19.89 26.04,18.11 36.58,18.11 37.34,17.35 37.34,17.16 U1.33 37.41,17.09 37.41,16.84 38.04,16.2 R14.2 | 19.56,19.89 18.99,19.89 IC4.6 | v15.31,20.08 v9.4,14.17 | 19.56,19.89 v19.56,20.08
  Bottom 0.127: v9.4,14.17 8.71,13.47 8.71,2.68 U$1.P$74 | v19.56,20.08 19.31,20.33 15.56,20.33 v15.31,20.08
SW1
  Top 0.127: U$15.1 7.37,35.25 4.45,35.25 4.26,35.06 L1.2 4.26,35 2.29,33.03 2.29,30.93 D6.A
SWCLK/SPK_SD
  Top 0.127: R5.1 7.25,17.22 7.12,17.09 IC2.4
TXO_ESP  (via drill 0.3)
  Top 0.127: v45.15,38.62 43.44,38.62 43.25,38.81 43.25,40.08 43.82,40.65 43.82,41.73 U3.20 | v36.77,41.09 36.52,41.09 TP_TX.T | v47.38,36.27 47.06,36.27 42.68,31.89 42.68,22.93 42.42,22.68 42.23,22.68 39.57,20.01 39.57,19.5 39.88,19.19 39.88,17.16 U1.35
  Bottom 0.127: v36.77,41.09 37.47,41.09 37.79,41.41 44.77,41.41 45.15,41.03 v45.15,38.62 47.38,36.4 v47.38,36.27
UCAP  (via drill 0.3)
  Top 0.127: v37.09,45.16 U3.6 | C18.2 v35.12,43.25
  Bottom 0.127: v37.09,45.16 35.18,43.25 v35.12,43.25
VBAT
  Top 0.127: U$15.4 9.21,37.98 8.32,37.98 U$15.5 8.32,40.46 7.82,40.97 D30.C 7.37,41.48 C15.1 4.26,40.84 L1.1
VBUS
  Top 0.254: D9.A 24.58,43.64 25.72,44.78 25.72,45.67 U$9.1

### Text on the board
tPlace: GND | GND | GND | VCC | VCC | VCC | 39 | 14 | TX 1 | 36 | 27 | RX 3 | RESET | GND | GND | GND | VCC | VCC | VCC | 34 | 16 | SDA / 21 | 35 | 17 | 5 | 1 | 3 | SCL / 22 | SDA / 21 | NC | 18 | 19 | 23 | 13 | 12 | 14 | 27 | 16 | 17 | 25 | 26 | PWR | SCL / 22 | GND | TX | RX | GND | GND | GND | VCC | VCC | VCC | 33 | 26 | SDA 21 | 32 | 25 | SCL 22 | IO18 | ANALOG IN | 0 | 3V3 | RST | 3V3 | 5V | GND | GND | 5V | 32 | 33 | 34 | 35 | 36 | 39
bPlate: A0 | A2 | A4 | SPI | UART